# EasyEDA schematic SCH_Quad miner_2023-09-12.json

## Sheets
1 EMC2101: TITLE: Sheet_1; REV: 1.0; Date: 2023-04-18; Sheet: 1/1; Drawn By: abonion1500; Company: Your Company
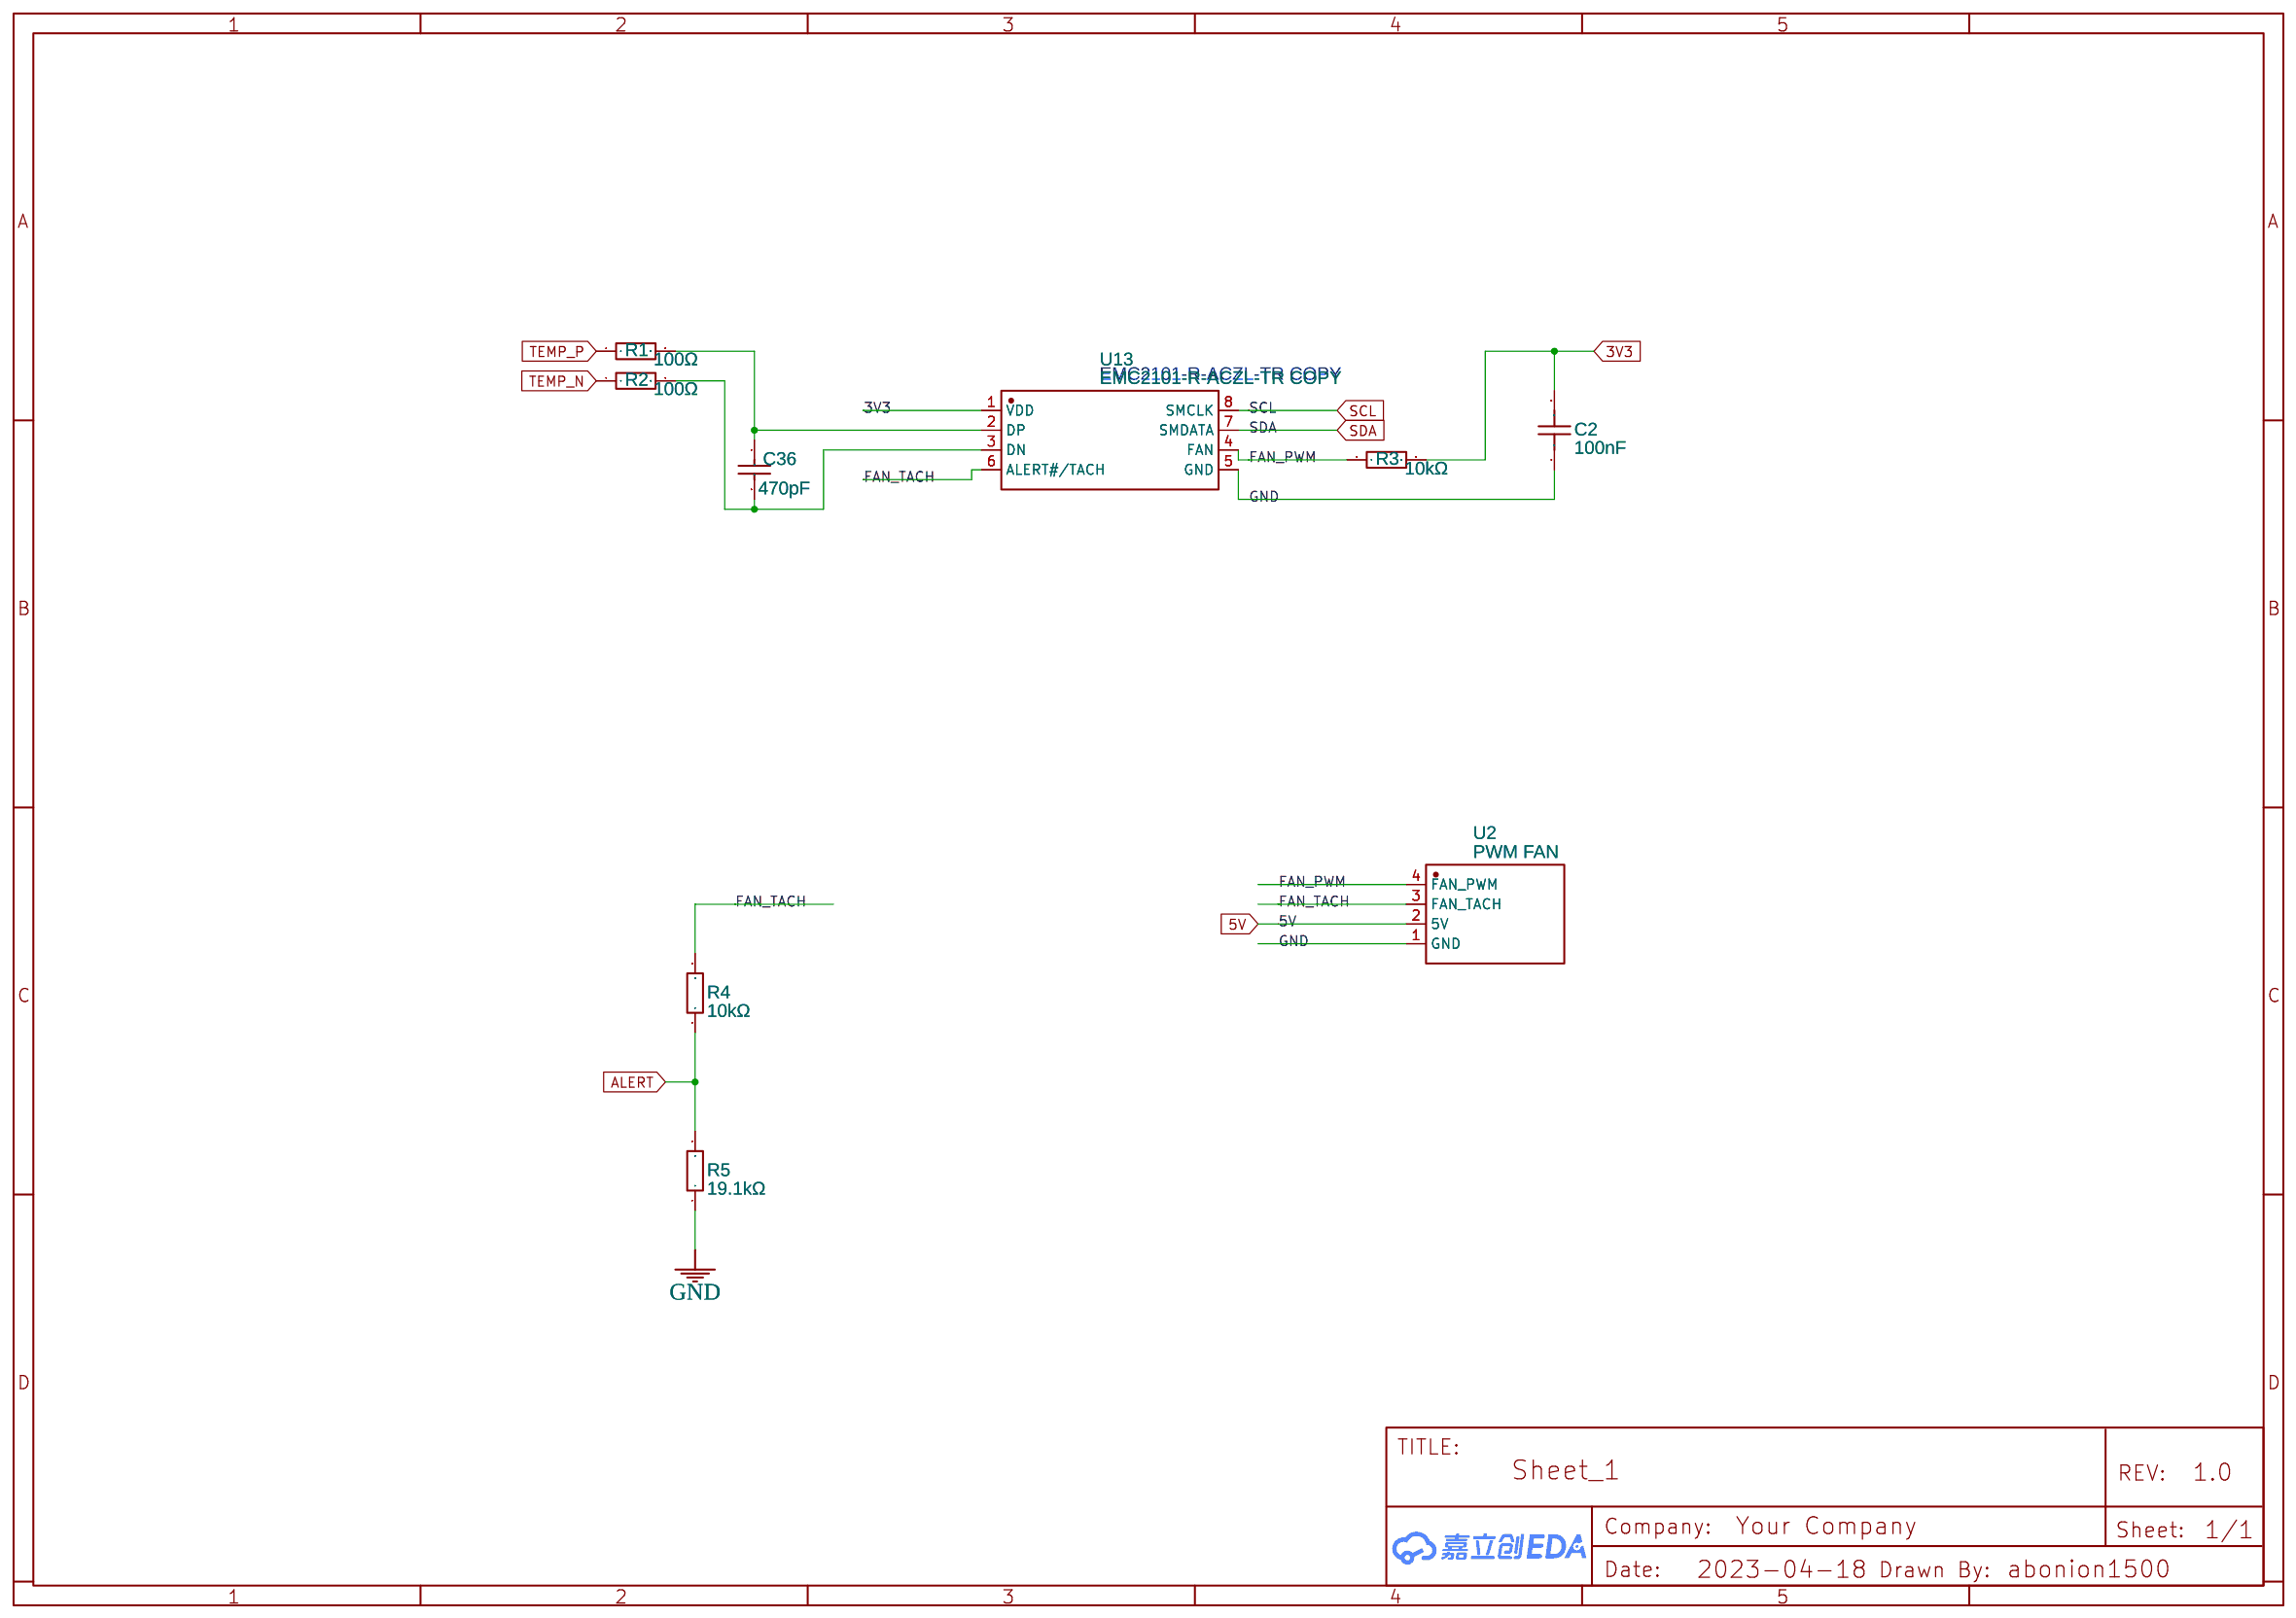
[diagram p0: EMC2101]
2 Logic: Date: 2023-09-11
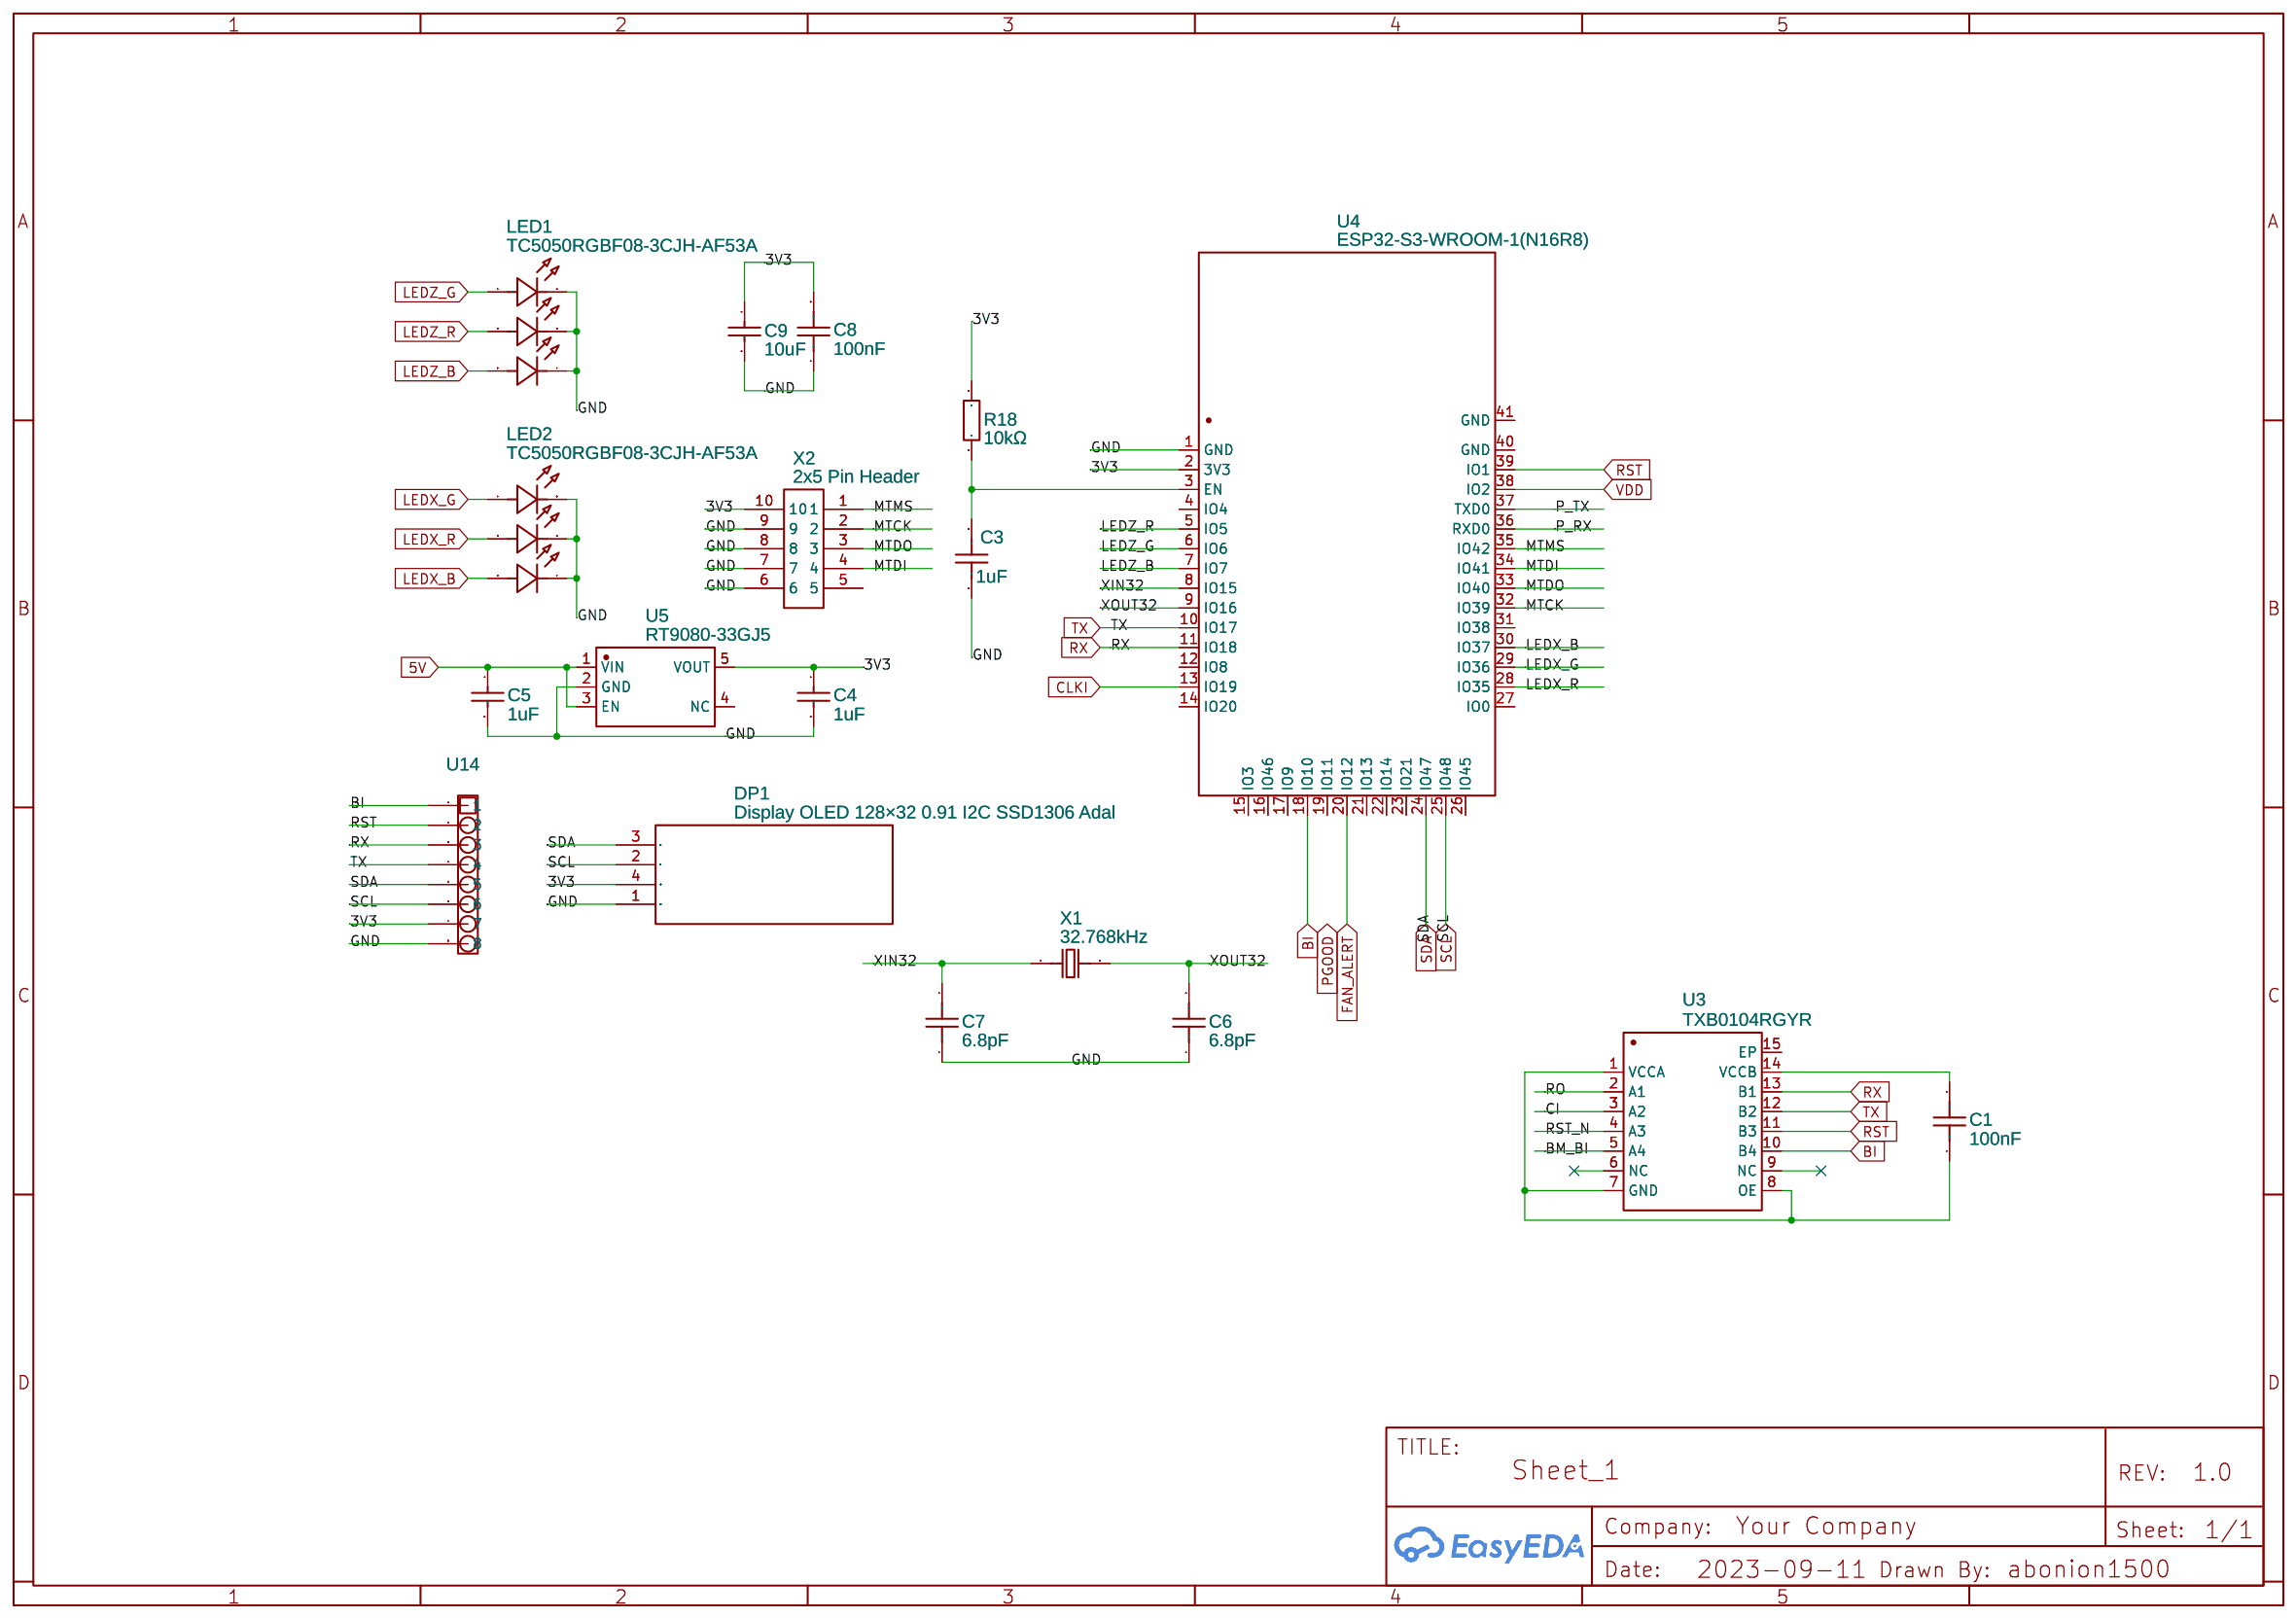
[diagram p1: Logic]
3 Ic1: TITLE: BM1397 MODE1; Date: 2023-07-06; Drawn By: abonion.1500; Company: Abonion1500
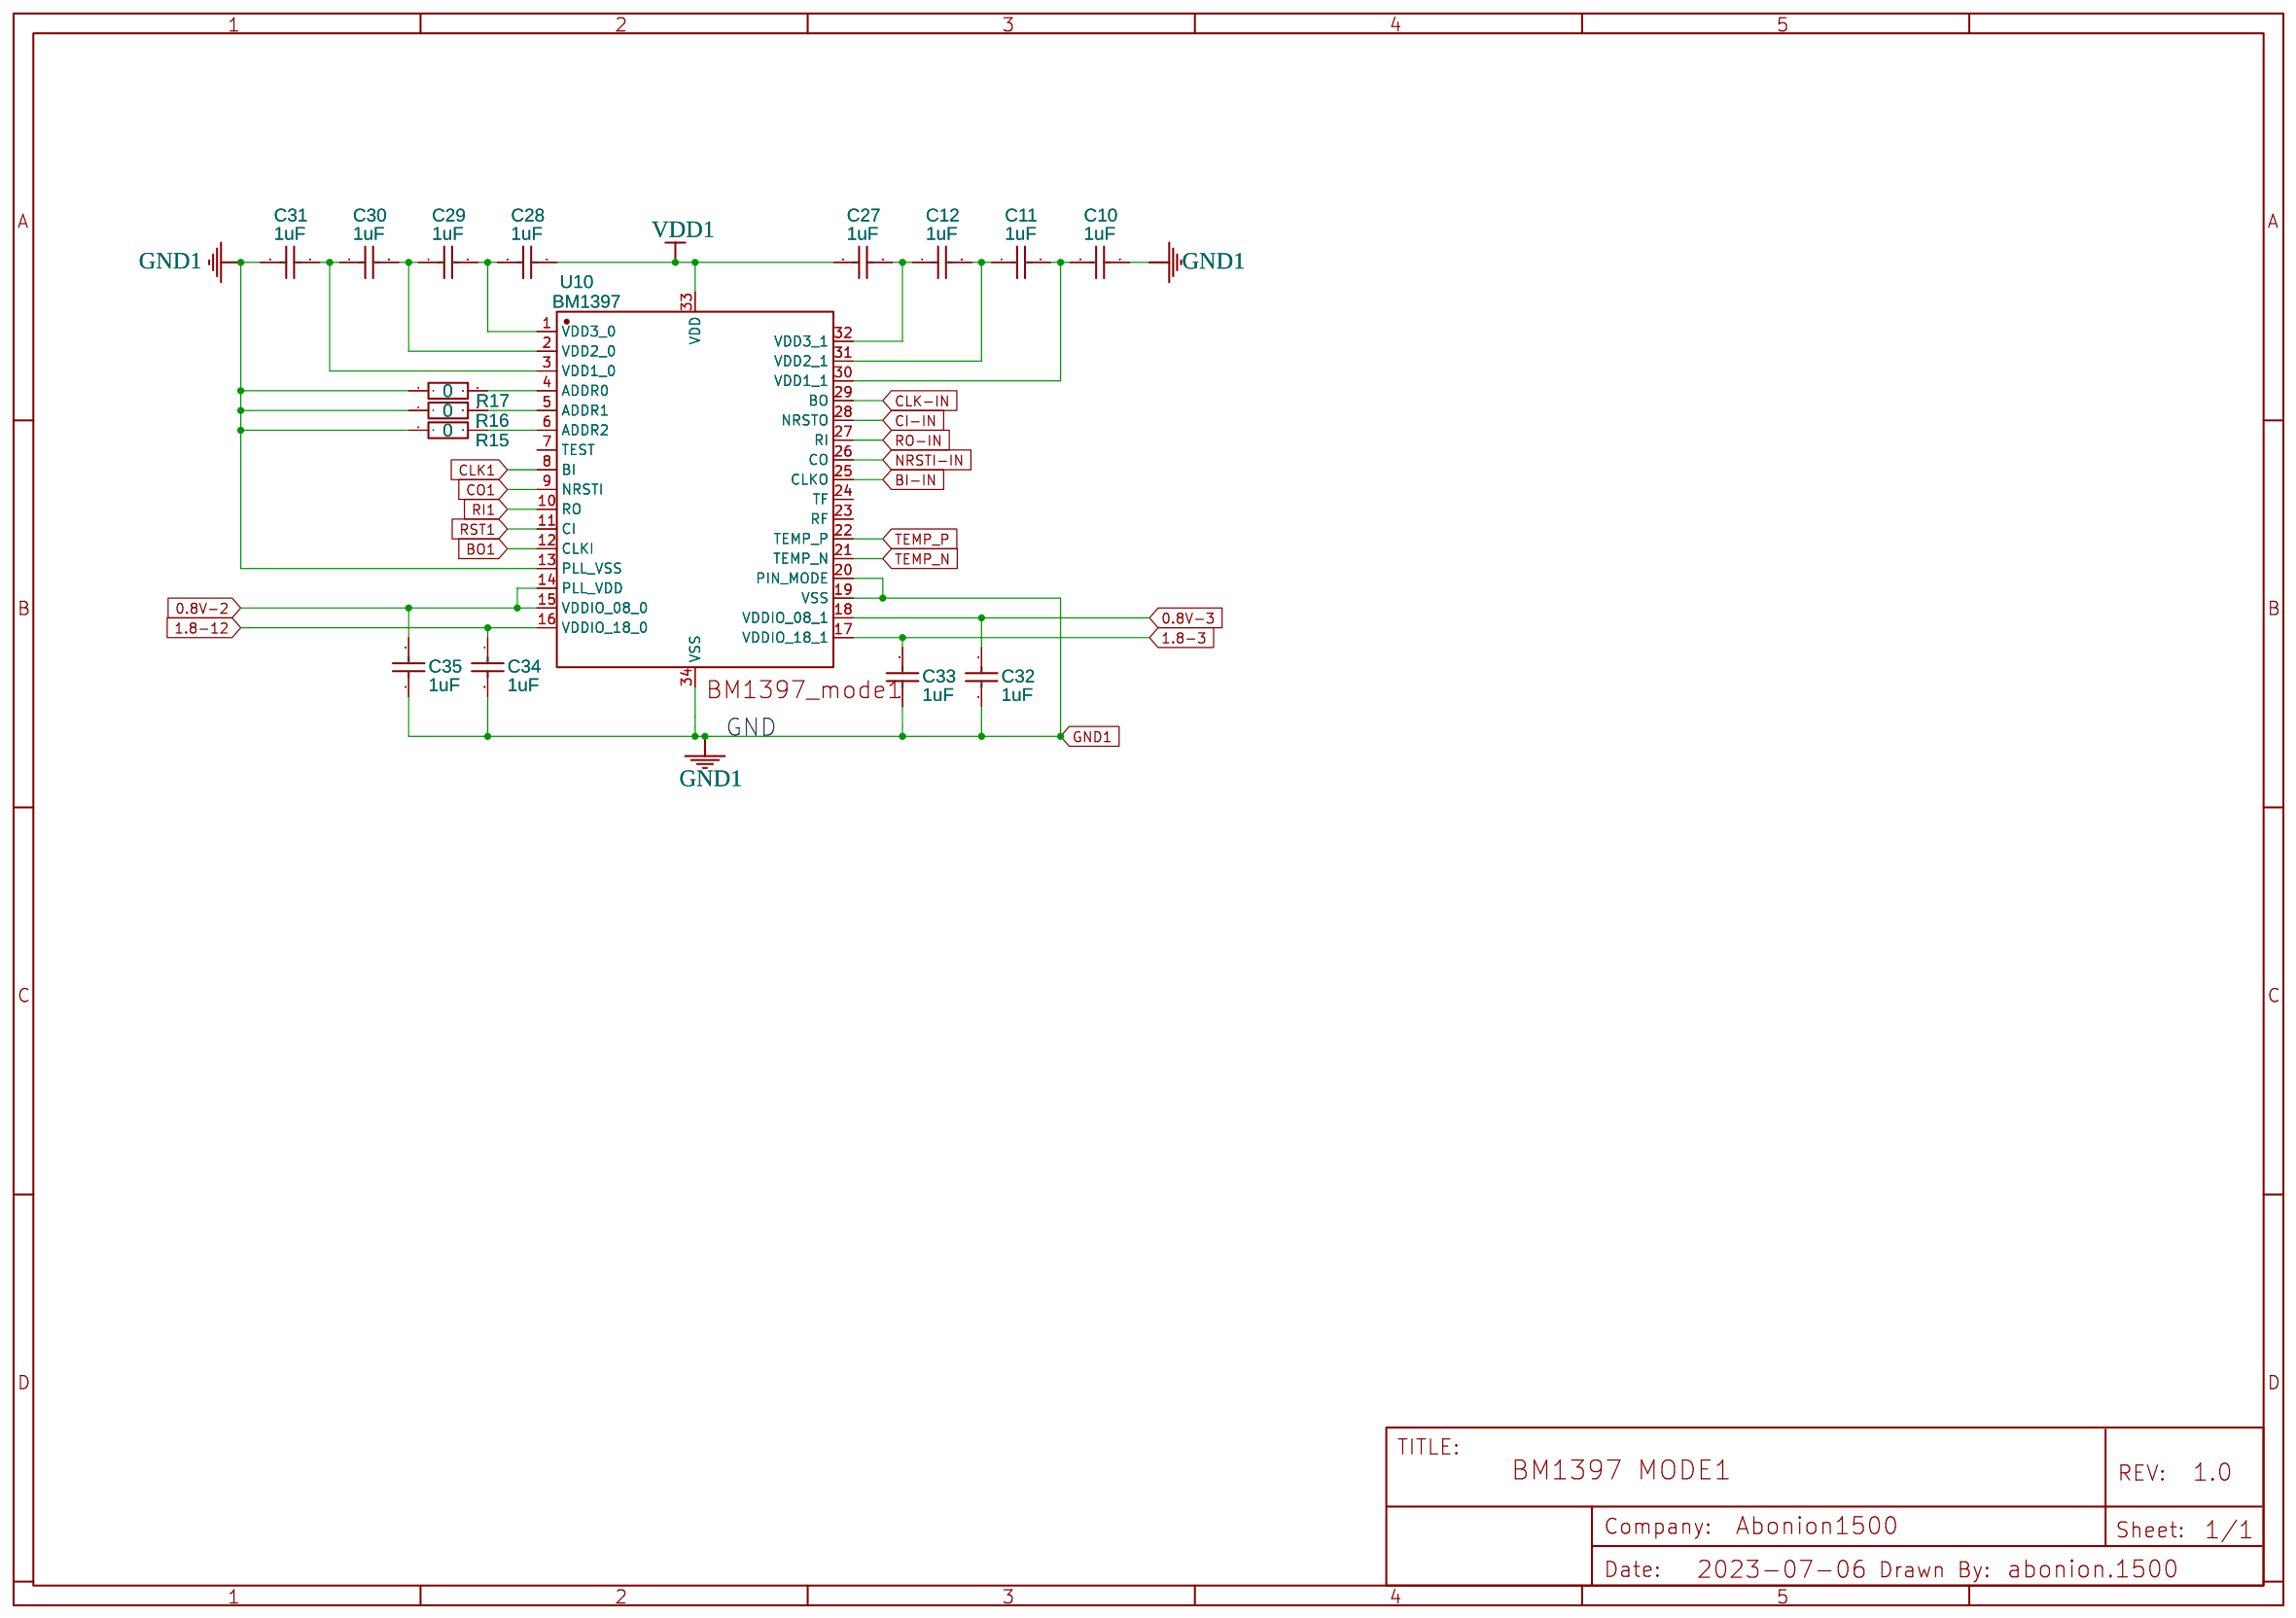
[diagram p2: Ic1]
4 Power main: Date: 2023-09-12
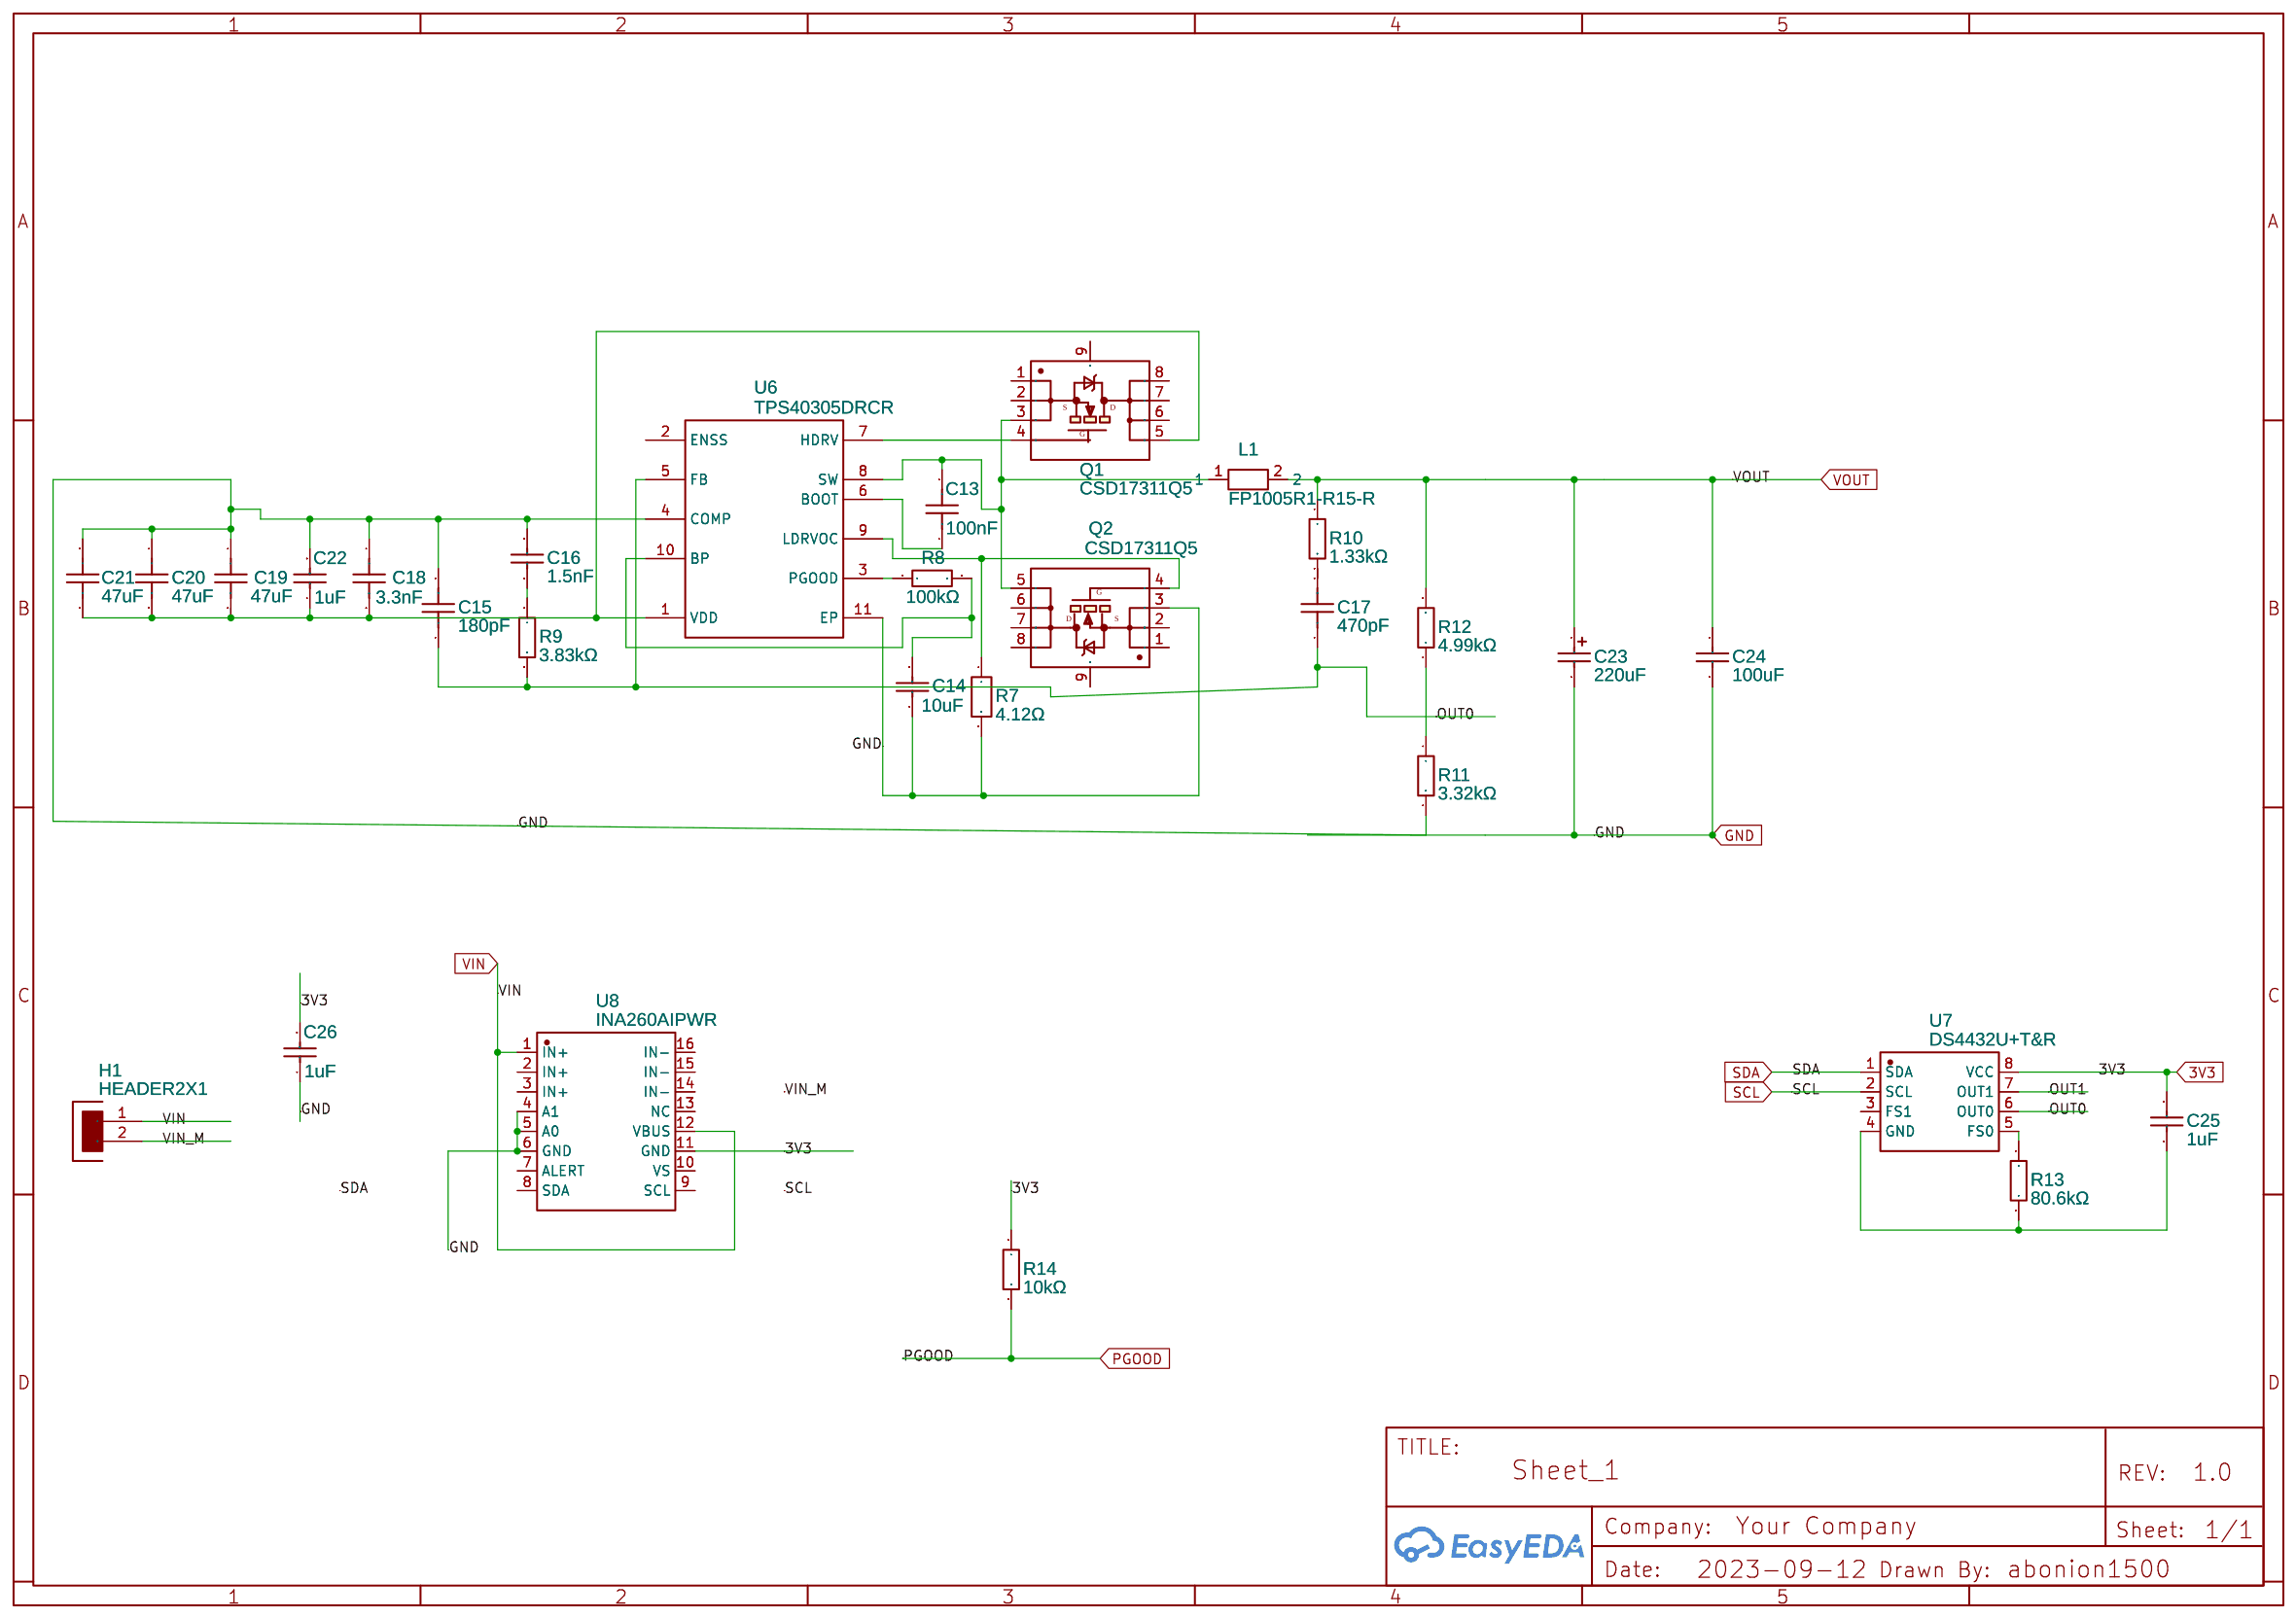
[diagram p3: Power main]
5 Ic2: Date: 2023-07-20; Drawn By: abonion.1500
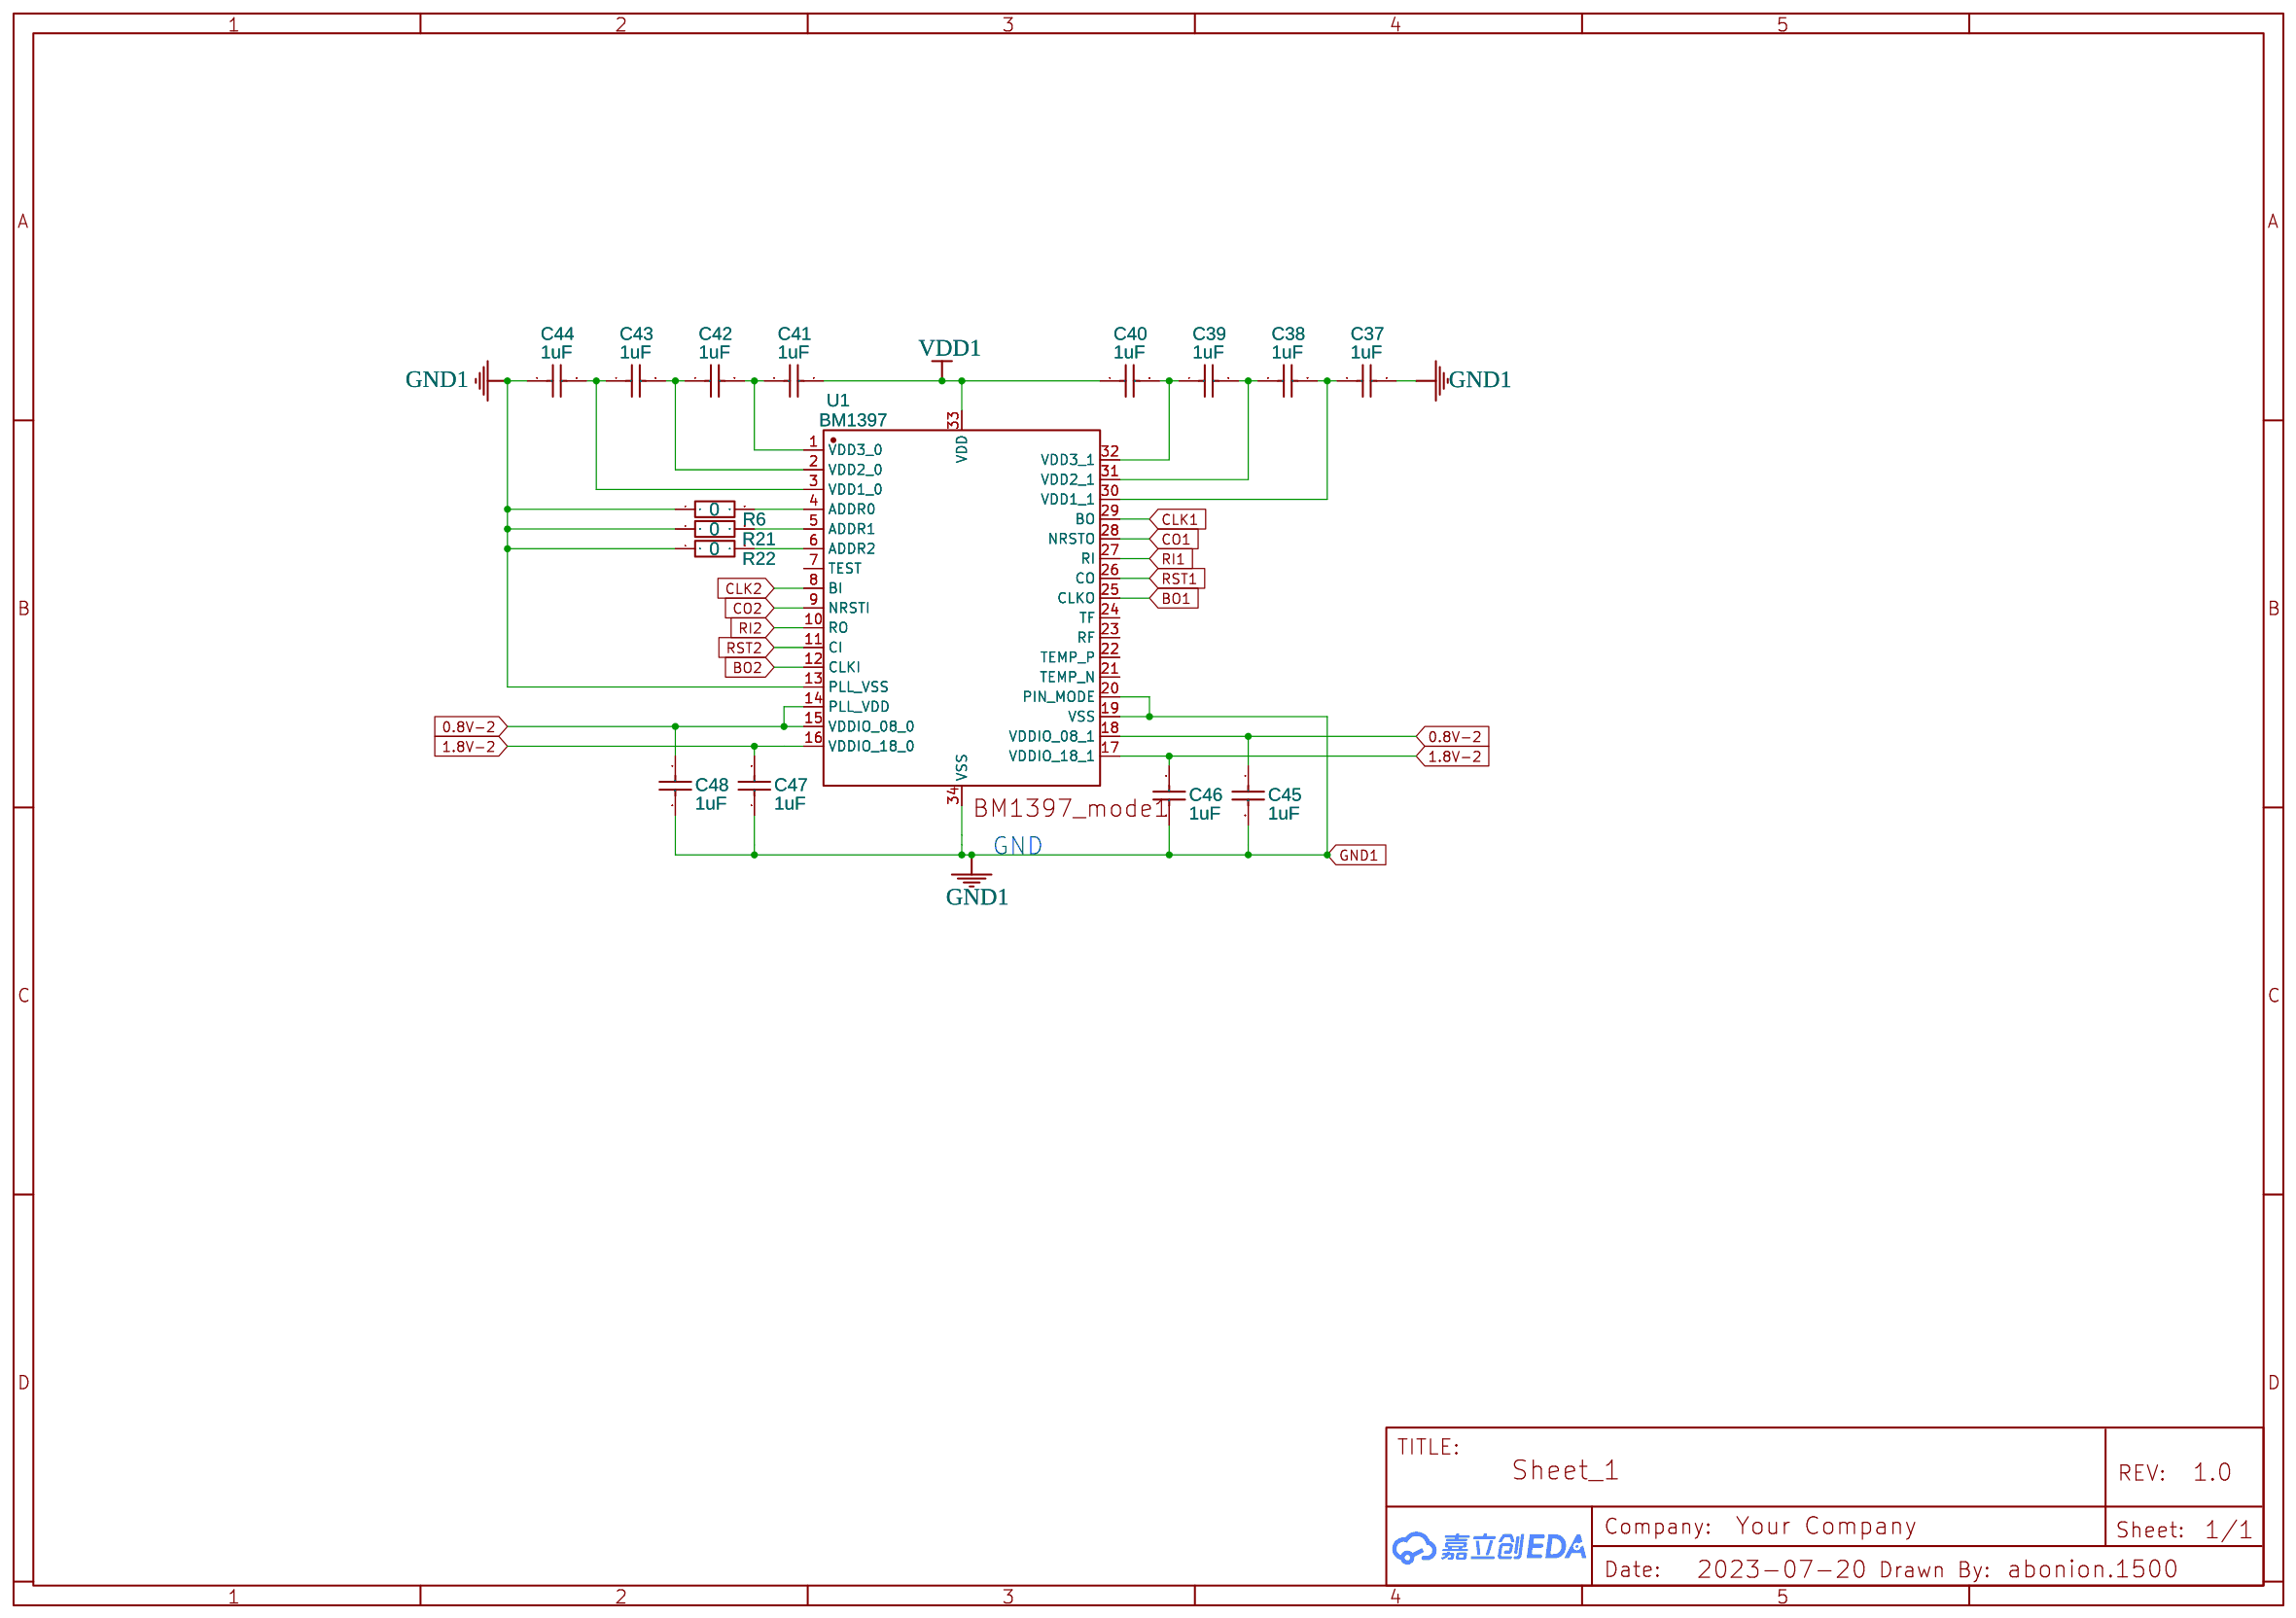
[diagram p4: Ic2]
6 Sheet_1: Date: 2023-09-12
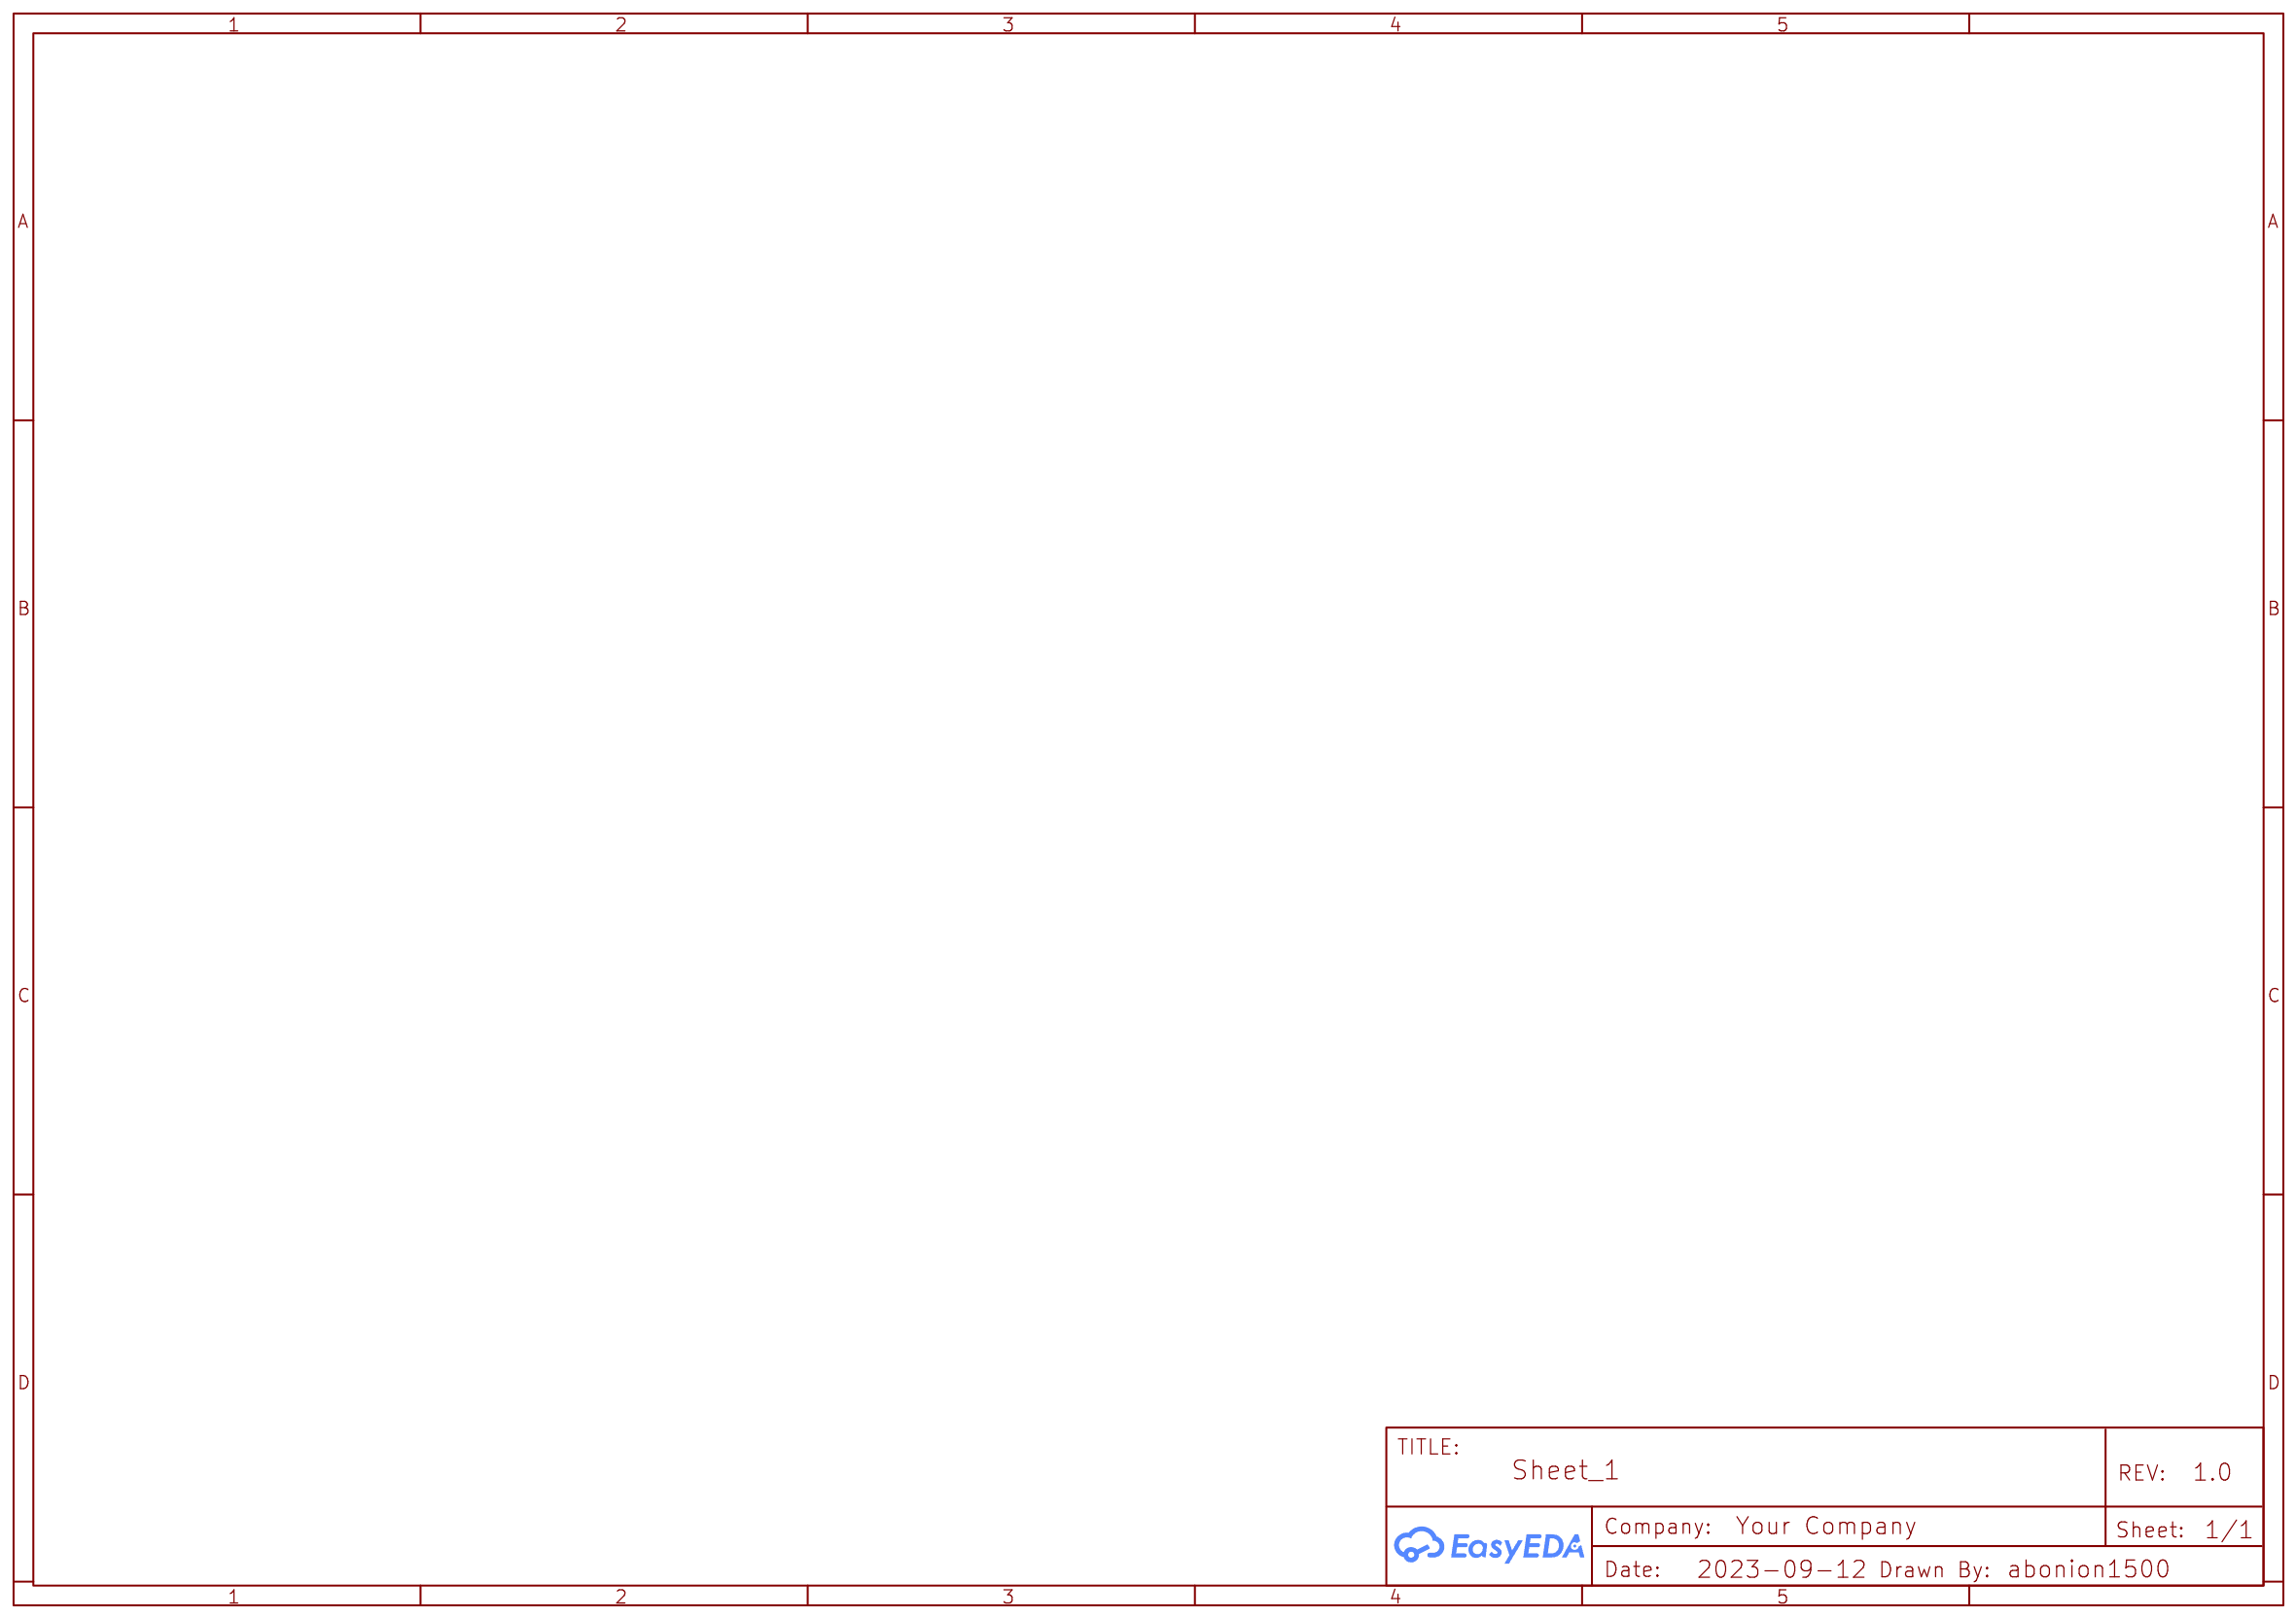
[diagram p5: Sheet_1]
7 Power ASICS: Date: 2023-07-21; Drawn By: abonion.1500
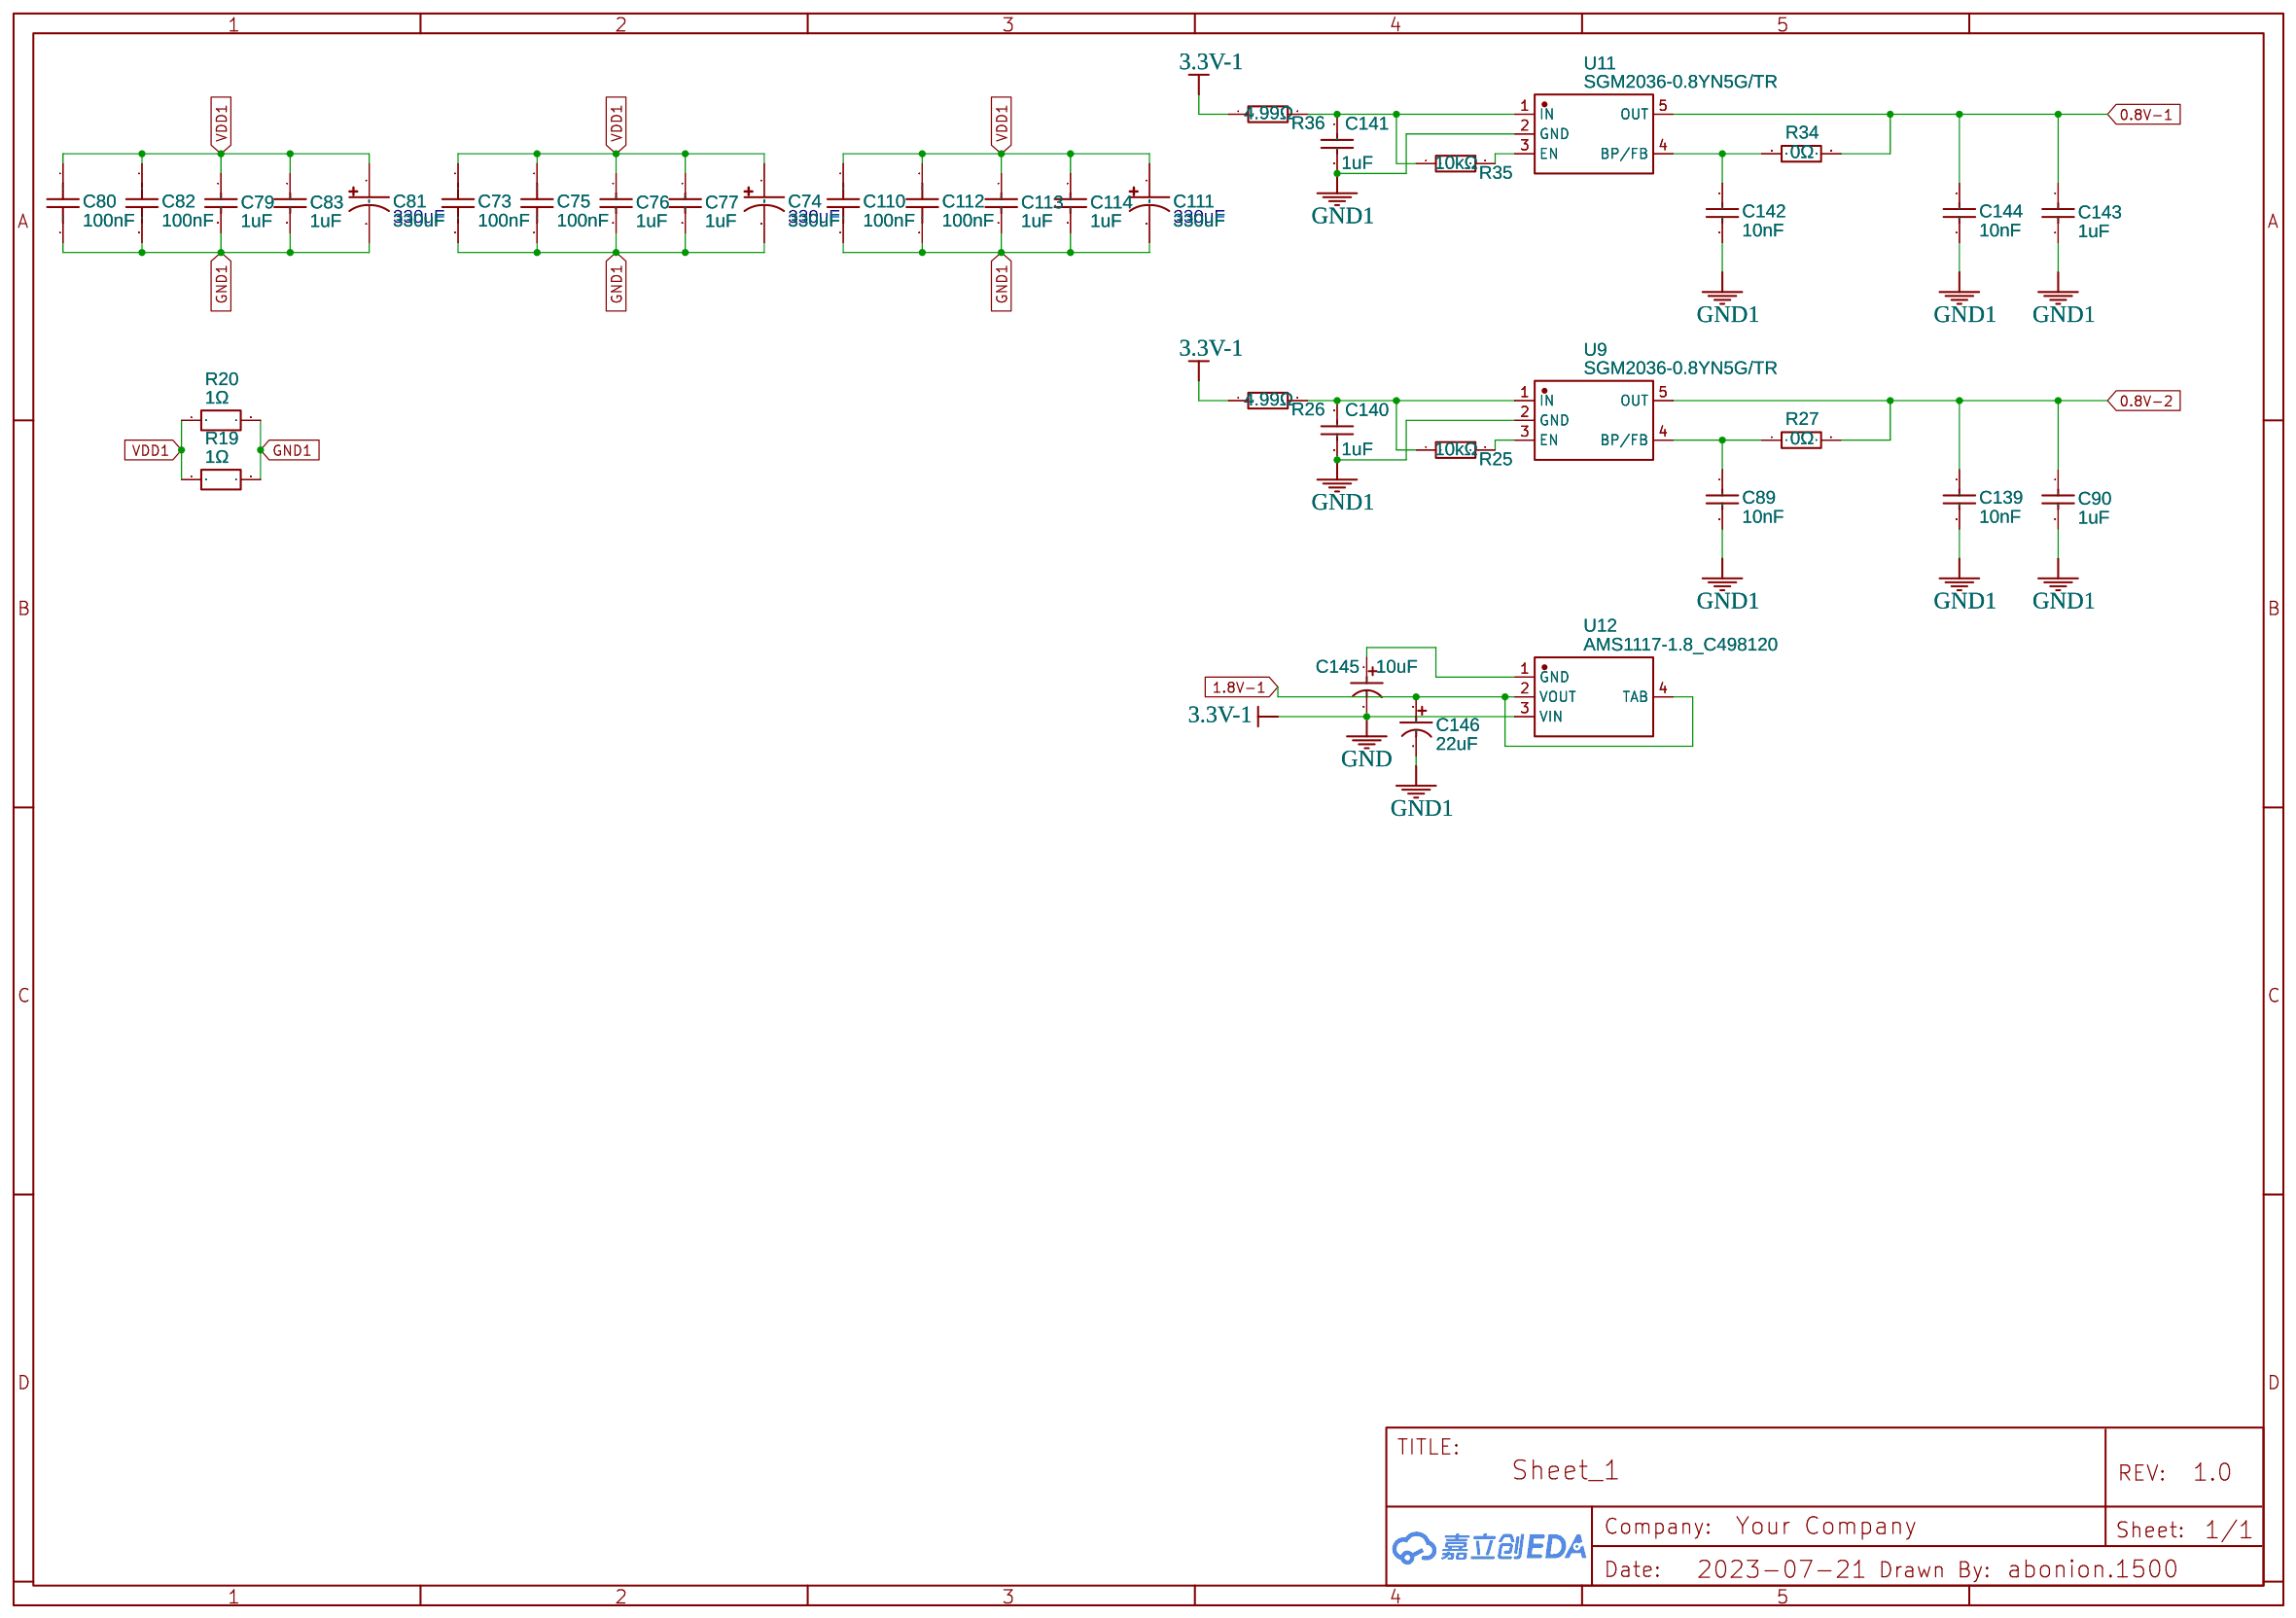
[diagram p6: Power ASICS]

## Parts
sheet EMC2101
C2  100nF  [C0402]
C36  470pF  [C0402]
R1  100Ω  [R0402]
R2  100Ω  [R0402]
R3  10kΩ  [R0402]
R4  10kΩ  [R0402]
R5  19.1kΩ  [R0402]
U2  PWM FAN  [PWM FAN HEADER COPY]
U13  EMC2101-R-ACZL-TR COPY  [MSOP-8_L3.0-W3.0-P0.65-LS4.9-BL]
sheet Ic1
C10  1uF  [C0402]
C11  1uF  [C0402]
C12  1uF  [C0402]
C27  1uF  [C0402]
C28  1uF  [C0402]
C29  1uF  [C0402]
C30  1uF  [C0402]
C31  1uF  [C0402]
C32  1uF  [C0402]
C33  1uF  [C0402]
C34  1uF  [C0402]
C35  1uF  [C0402]
R15  0  [R0402]
R16  0  [R0402]
R17  0  [R0402]
U10  BM1397  [BM1397]
sheet Ic2
C37  1uF  [C0402]
C38  1uF  [C0402]
C39  1uF  [C0402]
C40  1uF  [C0402]
C41  1uF  [C0402]
C42  1uF  [C0402]
C43  1uF  [C0402]
C44  1uF  [C0402]
C45  1uF  [C0402]
C46  1uF  [C0402]
C47  1uF  [C0402]
C48  1uF  [C0402]
R6  0  [R0402]
R21  0  [R0402]
R22  0  [R0402]
U1  BM1397  [BM1397]
sheet Logic
C1  100nF  [C0402]
C3  1uF  [C0603]
C4  1uF  [C0402]
C5  1uF  [C0402]
C6  6.8pF  [C0402]
C7  6.8pF  [C0402]
C8  100nF  [C0402]
C9  10uF  [C0805]
DP1  Display OLED 128×32 0.91 I2C SSD1306 Adal  [0.96OLED_4P]
LED1  TC5050RGBF08-3CJH-AF53A  [LED-SMD_6P-L5.0-W5.0-TL_TC5050RGBF08]
LED2  TC5050RGBF08-3CJH-AF53A  [LED-SMD_6P-L5.0-W5.0-TL_TC5050RGBF08]
R18  10kΩ  [R0402]
U3  TXB0104RGYR  [VQFN-14_L3.5-W3.5-P0.50-BL-EP]
U4  ESP32-S3-WROOM-1(N16R8)  [WIRELM-SMD_ESP32-S3-WROOM-1]
U5  RT9080-33GJ5  [TSOT-23-5_L2.9-W1.6-P0.95-LS2.8-BL]
U14  NO  [1X08 2.54MM HOLES HEADERS PINS]
X1  32.768kHz  [FC-135R_L3.2-W1.5]
X2  2x5 Pin Header  [2X5 PIN HEADERS]
sheet Power ASICS
C73  100nF  [C0402]
C74  330uF  [CAP-SMD_BD8.0-L8.3-W8.3-FD]
C75  100nF  [C0402]
C76  1uF  [C0402]
C77  1uF  [C0402]
C79  1uF  [C0402]
C80  100nF  [C0402]
C81  330uF  [CAP-SMD_BD8.0-L8.3-W8.3-FD]
C82  100nF  [C0402]
C83  1uF  [C0402]
C89  10nF  [C0402]
C90  1uF  [C0402]
C110  100nF  [C0402]
C111  330uF  [CAP-SMD_BD8.0-L8.3-W8.3-FD]
C112  100nF  [C0402]
C113  1uF  [C0402]
C114  1uF  [C0402]
C139  10nF  [C0402]
C140  1uF  [C0402]
C141  1uF  [C0402]
C142  10nF  [C0402]
C143  1uF  [C0402]
C144  10nF  [C0402]
C145  10uF  [CAP-SMD_BD6.3-L6.6-W6.6-FD]
C146  22uF  [CAP-SMD_BD6.3-L6.6-W6.6-LS7.4-FD]
R19  1Ω  [R01005]
R20  1Ω  [R01005]
R25  10kΩ  [R0402]
R26  4.99Ω  [R0201]
R27  0Ω  [R0402]
R34  0Ω  [R0402]
R35  10kΩ  [R0402]
R36  4.99Ω  [R0201]
U9  SGM2036-0.8YN5G/TR  [SOT-23-5_L2.9-W1.6-P0.95-LS2.8-BR]
U11  SGM2036-0.8YN5G/TR  [SOT-23-5_L2.9-W1.6-P0.95-LS2.8-BR]
U12  AMS1117-1.8_C498120  [SOT-223-3_L6.5-W3.4-P2.30-LS7.0-BR]
sheet Power main
C13  100nF  [C0402]
C14  10uF  [C0805]
C15  180pF  [C0805]
C16  1.5nF  [C0805]
C17  470pF  [C0805]
C18  3.3nF  [C0402]
C19  47uF  [C1210]
C20  47uF  [C1210]
C21  47uF  [C1210]
C22  1uF  [C0603]
C23  220uF  [CAP-SMD_L7.3-W4.3-L-FD]
C24  100uF  [C1206]
C25  1uF  [C0402]
C26  1uF  [C0603]
H1  HEADER2X1  [HEADER2X1_CL]
L1  FP1005R1-R15-R  [FP1005R1-R15-R]
Q1  CSD17311Q5  [VSON-8_L6.0-W5.0-P1.27-BL-EP]
Q2  CSD17311Q5  [VSON-8_L6.0-W5.0-P1.27-BL-EP]
R7  4.12Ω  [R0402]
R8  100kΩ  [R0402]
R9  3.83kΩ  [R0402]
R10  1.33kΩ  [R0402]
R11  3.32kΩ  [R0402]
R12  4.99kΩ  [R0402]
R13  80.6kΩ  [R0402]
R14  10kΩ  [R0402]
U6  TPS40305DRCR  [VSON-10_L3.0-W3.0-P0.50-BL-EP_TPS62410DRCR]
U7  DS4432U+T&R  [UMAX-8_L3.0-W3.0-P0.65-LS4.9-BL]
U8  INA260AIPWR  [TSSOP-16_L5.0-W4.4-P0.65-LS6.4-BL-1]

## Library data of the parts
C1 C2 C8 C13 = 0402X104K100CT: Contributor: LCSC; Supplier: LCSC; Supplier Part: C387958; Manufacturer: Walsin(华新科); JLCPCB Part Class: Extended Part; link: https://lcsc.com/eda_search?q=C387958&%26type=1&ref=editor
C36 = CL05B471KB5NNNC: Supplier: LCSC; Manufacturer: SAMSUNG(三星); Supplier Part: C26412; JLCPCB Part Class: Extended Part; link: https://lcsc.com/eda_search?q=C26412&%26type=1&ref=editor
R1 R2 = RMCF0402FT100R: Contributor: LCSC; Supplier: LCSC; Supplier Part: C237740; Manufacturer: SEI(Stackpole Electronics Inc.); JLCPCB Part Class: Extended Part; link: https://lcsc.com/eda_search?q=C237740&%26type=1&ref=editor
R3 R14 R18 = RC0402JR-0710KL: Supplier: LCSC; Manufacturer: YAGEO(国巨); Supplier Part: C60489; JLCPCB Part Class: Extended Part; link: https://lcsc.com/eda_search?q=C60489&%26type=1&ref=editor
R4 = RC-02W103JT_C140214: Contributor: LCSC; Supplier: LCSC; Supplier Part: C140214; Manufacturer: FH(风华); Manufacturer Part: RC-02W103JT; JLCPCB Part Class: Extended Part; link: https://lcsc.com/eda_search?q=C140214&%26type=1&ref=editor
R5 = 0402WGF1912TCE: Supplier: LCSC; Manufacturer: UNI-ROYAL(厚声); Supplier Part: C52036; JLCPCB Part Class: Extended Part; link: https://lcsc.com/eda_search?q=C52036&%26type=1&ref=editor
U2 = PWM FAN: Contributor: abonion1500
U13 = EMC2101-R-ACZL-TR COPY: Contributor: lcsc; Supplier: LCSC; Supplier Part: C626968; Manufacturer: MICROCHIP(美国微芯); Manufacturer Part: EMC2101-R-ACZL-TR; JLCPCB Part Class: Extended Part
C10-C12 C25 C27-C35 C37-C48 C76 C77 C79 C83 C90 C113 C114 C140 C141 C143 = CL05A105KO5NNNC: Supplier: LCSC; Manufacturer: SAMSUNG(三星); Supplier Part: C29266; JLCPCB Part Class: Extended Part
R6 R15-R17 R21 R22 = RC0402JR-070RL: Supplier: LCSC; Manufacturer: YAGEO(国巨); Supplier Part: C60485; JLCPCB Part Class: Extended Part; Resistance: 0Ω
U1 U10 = BM1397: Manufacturer: Bitmain; Contributor: abonion.1500
C3 = 0603X105J160CT: Contributor: LCSC; Supplier: LCSC; Supplier Part: C458913; Manufacturer: Walsin(华新科); JLCPCB Part Class: Extended Part; link: https://lcsc.com/eda_search?q=C458913&%26type=1&ref=editor
C4 C5 = CL05A105KO5NNNC: Supplier: LCSC; Manufacturer: SAMSUNG(三星); Supplier Part: C29266; JLCPCB Part Class: Extended Part; link: https://lcsc.com/eda_search?q=C29266&%26type=1&ref=editor
C6 C7 = C1005NPO689DGT: Contributor: LCSC; Supplier: LCSC; Supplier Part: C258499; Manufacturer: DARFON(达方); Manufacturer Part: C1005NP0689DGT; JLCPCB Part Class: Extended Part; link: https://lcsc.com/eda_search?q=C258499&%26type=1&ref=editor
C9 C14 = CL21A106KOQNNNE: Supplier: LCSC; Manufacturer: SAMSUNG(三星); Supplier Part: C1713; JLCPCB Part Class: Extended Part; link: https://lcsc.com/eda_search?q=C1713&%26type=1&ref=editor
DP1 = Display OLED 128×32 0.91 I2C SSD1306 Adal: Contributor: adal
LED1 LED2 = TC5050RGBF08-3CJH-AF53A: Contributor: LCSC; Supplier: LCSC; Supplier Part: C784540; Manufacturer: TCWIN(天成); JLCPCB Part Class: Extended Part; link: https://lcsc.com/eda_search?q=C784540&%26type=1&ref=editor
U3 = TXB0104RGYR: Contributor: LCSC; Supplier: LCSC; Supplier Part: C400708; Manufacturer: TI(德州仪器); JLCPCB Part Class: Extended Part; link: https://lcsc.com/eda_search?q=C400708&%26type=1&ref=editor
U4 = ESP32-S3-WROOM-1(N16R8): Contributor: lcsc; Supplier: LCSC; Supplier Part: C2913202; Manufacturer: ESPRESSIF(乐鑫); Manufacturer Part: ESP32-S3-WROOM-1-N16R8; JLCPCB Part Class: Extended Part; link: https://lcsc.com/eda_search?q=C2913202&%26type=1&ref=editor
U5 = RT9080-33GJ5: Contributor: LCSC; Supplier: LCSC; Supplier Part: C841192; Manufacturer: RICHTEK(台湾立锜); JLCPCB Part Class: Extended Part; link: https://lcsc.com/eda_search?q=C841192&%26type=1&ref=editor
U14 = Header pins 1X08: Contributor: fabiano.riccardi
X1 = Q13FC1350000200: Supplier: LCSC; Manufacturer: EPSON(爱普生); Supplier Part: C48615; JLCPCB Part Class: Extended Part; link: https://lcsc.com/eda_search?q=C48615&%26type=1&ref=editor
X2 = 2x5 Pin Header: Contributor: WooDFox
C73 C75 C80 C82 C110 C112 = CC0402KRX7R7BB104: Supplier: LCSC; Manufacturer: YAGEO(国巨); Supplier Part: C60474; JLCPCB Part Class: Extended Part
C74 C81 C111 = RVE1C331M0810: Supplier: LCSC; Manufacturer: HONOR(荣誉); Supplier Part: C88669; JLCPCB Part Class: Extended Part
C89 C139 C142 C144 = 0402B103K500NT: Supplier: LCSC; Manufacturer: FH(风华); Supplier Part: C1524; JLCPCB Part Class: Extended Part
C145 = RVT2A100M0607: Supplier: LCSC; Manufacturer: ROQANG(容强); Supplier Part: C72482; JLCPCB Part Class: Extended Part
C146 = RT1J220M0607: Contributor: LCSC; Supplier: LCSC; Supplier Part: C267472; Manufacturer: ROQANG(容强); JLCPCB Part Class: Extended Part
R19 R20 = 0105WHF100KTDE: Supplier: LCSC; Supplier Part: C560312; Manufacturer: UNI-ROYAL(厚声); Contributor: LCSC
R25 R35 = 0402WGF1002TCE: Supplier: LCSC; Manufacturer: UNI-ROYAL(厚声); Supplier Part: C25744; Resistance (Ohms): 10K; JLCPCB Part Class: Basic Part
R26 R36 = RTT014R99FTH: Supplier: LCSC; Manufacturer: RALEC(旺诠); Resistance (Ohms): 4.99; Contributor: LCSC; Supplier Part: C158479
R27 R34 = 0402WGF0000TCE: Supplier: LCSC; Manufacturer: UNI-ROYAL(厚声); Supplier Part: C17168; Resistance (Ohms): 0; JLCPCB Part Class: Basic Part
U9 U11 = SGM2036-0.8YN5G/TR: Supplier: LCSC; Supplier Part: C700345; Manufacturer: SGMICRO(圣邦微); link: https://atta.szlcsc.comnull; Contributor: lcsc; JLCPCB Part Class: Extended Part
U12 = AMS1117-1.8_C498120: Contributor: LCSC; Supplier: LCSC; Supplier Part: C498120; Manufacturer: HGC(华冠); Manufacturer Part: AMS1117-1.8; JLCPCB Part Class: Extended Part
C15 = CC0805JRNPO9BN181: Contributor: LCSC; Supplier: LCSC; Supplier Part: C113826; Manufacturer: YAGEO(国巨); JLCPCB Part Class: Extended Part; link: https://lcsc.com/eda_search?q=C113826&%26type=1&ref=editor
C16 = CC0805KRX7R9BB152: Supplier: LCSC; Manufacturer: YAGEO(国巨); Supplier Part: C107142; JLCPCB Part Class: Extended Part; link: https://lcsc.com/eda_search?q=C107142&%26type=1&ref=editor
C17 = 0805B471K500CT: Contributor: LCSC; Supplier: LCSC; Supplier Part: C338123; Manufacturer: Walsin(华新科); JLCPCB Part Class: Extended Part; link: https://lcsc.com/eda_search?q=C338123&%26type=1&ref=editor
C18 = CL05B332KB5NNNC: Supplier: LCSC; Manufacturer: SAMSUNG(三星); Supplier Part: C26404; JLCPCB Part Class: Basic Part; link: https://lcsc.com/eda_search?q=C26404&%26type=1&ref=editor
C19-C21 = GRM32ER61C476KE15L: Supplier: LCSC; Manufacturer: muRata(村田); Supplier Part: C77101; JLCPCB Part Class: Extended Part; link: https://lcsc.com/eda_search?q=C77101&%26type=1&ref=editor
C22 C26 = CL10A105KO8NNNC: Supplier: LCSC; Manufacturer: SAMSUNG(三星); Supplier Part: C1592; JLCPCB Part Class: Extended Part; link: https://lcsc.com/eda_search?q=C1592&%26type=1&ref=editor
C23 = 2R5TPE220MF: Contributor: LCSC; Supplier: LCSC; Supplier Part: C437671; Manufacturer: PANASONIC(松下); JLCPCB Part Class: Extended Part; link: https://lcsc.com/eda_search?q=C437671&%26type=1&ref=editor
C24 = CL31A107MQHNNNE: Supplier: LCSC; Manufacturer: SAMSUNG(三星); Supplier Part: C15008; JLCPCB Part Class: Basic Part; link: https://lcsc.com/eda_search?q=C15008&%26type=1&ref=editor
H1 = HEADER2X1: Contributor: alexanderxxxx; sourceId: gEezxvt31; Manufacturer Part: n/a; Supplier Part: n/a; Manufacturer: n/a; link: n/a
L1 = FP1005R1-R15-R: Contributor: abonion1500; Package Display: No
Q1 Q2 = CSD17311Q5: Contributor: LCSC; Supplier: LCSC; Supplier Part: C139640; Manufacturer: TI(德州仪器); JLCPCB Part Class: Extended Part; link: https://lcsc.com/eda_search?q=C139640&%26type=1&ref=editor
R7 = RC0402FR-074R12L: Contributor: LCSC; Supplier: LCSC; Supplier Part: C477720; Manufacturer: YAGEO(国巨); JLCPCB Part Class: Extended Part; link: https://lcsc.com/eda_search?q=C477720&%26type=1&ref=editor
R8 = RC0402JR-07100KL: Supplier: LCSC; Manufacturer: YAGEO(国巨); Supplier Part: C106234; JLCPCB Part Class: Extended Part; link: https://lcsc.com/eda_search?q=C106234&%26type=1&ref=editor
R9 = RC0402FR-073K83L: Contributor: LCSC; Supplier: LCSC; Supplier Part: C185417; Manufacturer: YAGEO(国巨); JLCPCB Part Class: Extended Part; link: https://lcsc.com/eda_search?q=C185417&%26type=1&ref=editor
R10 = RC0402FR-071K33L: Contributor: LCSC; Supplier: LCSC; Supplier Part: C276261; Manufacturer: YAGEO(国巨); JLCPCB Part Class: Extended Part; link: https://lcsc.com/eda_search?q=C276261&%26type=1&ref=editor
R11 = RC0402FR-073K32L: Supplier: LCSC; Manufacturer: YAGEO(国巨); Supplier Part: C137993; JLCPCB Part Class: Extended Part; link: https://lcsc.com/eda_search?q=C137993&%26type=1&ref=editor
R12 = RC0402FR-074K99L: JLCPCB Part Class: Extended Part; Supplier: LCSC; Manufacturer: YAGEO(国巨); Supplier Part: C137965; link: https://lcsc.com/eda_search?q=C137965&%26type=1&ref=editor
R13 = RC0402FR-0780K6L: Contributor: LCSC; Supplier: LCSC; Manufacturer: YAGEO(国巨); Supplier Part: C155698; JLCPCB Part Class: Extended Part; link: https://lcsc.com/eda_search?q=C155698&%26type=1&ref=editor
U6 = TPS40305DRCR: Contributor: LCSC; Supplier: LCSC; Supplier Part: C140285; Manufacturer: TI(德州仪器); JLCPCB Part Class: Extended Part; link: https://lcsc.com/eda_search?q=C140285&%26type=1&ref=editor
U7 = DS4432U+T&amp;R: Contributor: LCSC; Supplier: LCSC; Supplier Part: C2679620; Manufacturer: ADI(亚德诺)/MAXIM(美信); JLCPCB Part Class: Extended Part; link: https://lcsc.com/eda_search?q=C2679620&%26type=1&ref=editor
U8 = INA260AIPWR: Contributor: lcsc; Supplier: LCSC; Supplier Part: C2155885; Manufacturer: TI(德州仪器); JLCPCB Part Class: Extended Part; link: https://lcsc.com/eda_search?q=C2155885&%26type=1&ref=editor

## Nets
0.8V-1: C143.1 C144.1 R34.2 U11.5(OUT)
0.8V-2: C35.1 C45.1 C48.1 C90.1 C139.1 R27.2 U1.14(PLL_VDD) U1.15(VDDIO_08_0) U1.18(VDDIO_08_1) U9.5(OUT) U10.14(PLL_VDD) U10.15(VDDIO_08_0)
0.8V-3: C32.1 U10.18(VDDIO_08_1)
1.8V-1: C146.1 U12.2(VOUT) U12.4(TAB)
1.8V-2: C46.1 C47.1 U1.16(VDDIO_18_0) U1.17(VDDIO_18_1)
3.3V-1: C2.1 C3.2 C4.2 C5.2 C6.1 C7.1 C8.1 C9.2 C14.1 C23.2 C24.2 C26.1 C145.2 DP1.1(GND) LED1.4(-) LED1.5(-) LED1.6(-) LED2.4(-) LED2.5(-) LED2.6(-) Q2.3(S) R5.1 R7.2 R26.1 R36.1 U2.1(GND) U4.1(GND) U5.2(GND) U6.11(EP) U8.4(A1) U8.5(A0) U8.6(GND) U12.3(VIN) U13.5(GND) U14.8 X2.6 X2.7 X2.8 X2.9
3V3: C2.2 C4.1 C8.2 C9.1 C25.1 C26.2 DP1.4(VCC) R3.2 R14.1 R18.1 U4.2(3V3) U5.5(VOUT) U7.8(VCC) U8.11(GND) U13.1(VDD) U14.7 X2.10
5V: C5.1 U2.2(5V) U5.1(VIN) U5.3(EN)
GND1: C10.2 C31.1 C32.2 C33.2 C34.2 C35.2 C37.2 C44.1 C45.2 C46.2 C47.2 C48.2 C73.2 C74.2 C75.2 C76.2 C77.2 C79.2 C80.2 C81.2 C82.2 C83.2 C89.2 C90.2 C110.2 C111.2 C112.2 C113.2 C114.2 C139.2 C140.2 C141.2 C142.2 C143.2 C144.2 C146.2 R6.1 R15.1 R16.1 R17.1 R19.2 R20.2 R21.1 R22.1 U1.13(PLL_VSS) U1.19(VSS) U1.20(PIN_MODE) U1.34(VSS) U9.2(GND) U10.13(PLL_VSS) U10.19(VSS) U10.20(PIN_MODE) U10.34(VSS) U11.2(GND)
VDD: U4.38(IO2)
VDD1: C27.1 C28.2 C40.1 C41.2 C73.1 C74.1 C75.1 C76.1 C77.1 C79.1 C80.1 C81.1 C82.1 C83.1 C110.1 C111.1 C112.1 C113.1 C114.1 R19.1 R20.1 U1.33(VDD) U10.33(VDD)
VIN: H1.1 U8.1(IN+) U8.12(VBUS)
VIN_M: H1.2
1.8-3: C33.1 U10.17(VDDIO_18_1)
1.8-12: C34.1 U10.16(VDDIO_18_0)
ALERT: R4.1 R5.2
BI: U3.10(B4) U4.18(IO10) U14.1
BI-IN: U10.25(CLKO)
BM_BI: U3.5(A4)
BO1: U1.25(CLKO) U10.12(CLKI)
BO2: U1.12(CLKI)
CI: U3.3(A2)
CI-IN: U10.28(NRSTO)
CLK1: U1.29(BO) U10.8(BI)
CLK2: U1.8(BI)
CLK-IN: U10.29(BO)
CLKI: U4.13(IO19)
CO1: U1.28(NRSTO) U10.9(NRSTI)
CO2: U1.9(NRSTI)
FAN_ALERT: U4.20(IO12)
FAN_PWM: R3.1 U2.4(FAN_PWM) U13.4(FAN)
FAN_TACH: R4.2 U2.3(FAN_TACH) U13.6(ALERT#/TACH)
LEDX_B: LED2.3(+) U4.30(IO37)
LEDX_G: LED2.1(+) U4.29(IO36)
LEDX_R: LED2.2(+) U4.28(IO35)
LEDZ_B: LED1.3(+) U4.7(IO7)
LEDZ_G: LED1.1(+) U4.6(IO6)
LEDZ_R: LED1.2(+) U4.5(IO5)
MTCK: U4.32(IO39) X2.2
MTDI: U4.34(IO41) X2.4
MTDO: U4.33(IO40) X2.3
MTMS: U4.35(IO42) X2.1
NRSTI-IN: U10.26(CO)
OUT0: C15.1 C17.1 R9.2 U6.5(FB) U7.6(OUT0)
OUT1: U7.7(OUT1)
P_RX: U4.36(RXD0)
P_TX: U4.37(TXD0)
PGOOD: R14.2
RI1: U1.27(RI) U10.10(RO)
RI2: U1.10(RO)
RO: U3.2(A1)
RO-IN: U10.27(RI)
RST: U3.11(B3) U4.39(IO1) U14.2
RST1: U1.26(CO) U10.11(CI)
RST2: U1.11(CI)
RST_N: U3.4(A3)
RX: U3.13(B1) U4.11(IO18) U14.3
SCL: DP1.2(SCL) U4.25(IO48) U7.2(SCL) U13.8(SMCLK) U14.6
SDA: DP1.3(SDA) U4.24(IO47) U7.1(SDA) U13.7(SMDATA) U14.5
TEMP_N: R2.1 U10.21(TEMP_N)
TEMP_P: R1.1 U10.22(TEMP_P)
TX: U3.12(B2) U4.10(IO17) U14.4
VOUT: C23.1 C24.1 L1.2 R10.1 R12.2
XIN32: C7.2 U4.8(IO15) X1.1
XOUT32: C6.2 U4.9(IO16) X1.2
Net-(C1-1): C1.1 U3.1(VCCA) U3.7(GND) U3.8(OE)
Net-(C1-2): C1.2 U3.14(VCCB)
Net-(C3-1): C3.1 R18.2 U4.3(EN)
Net-(C10-1): C10.1 C11.2 U10.30(VDD1_1)
Net-(C11-1): C11.1 C12.2 U10.31(VDD2_1)
Net-(C12-1): C12.1 C27.2 U10.32(VDD3_1)
Net-(C13-1): C13.1 U6.6(BOOT)
Net-(C13-2): C13.2 L1.1 Q1.3(S) Q2.5(D) U6.8(SW)
Net-(C14-2): C14.2 R8.2 U6.10(BP)
Net-(C15-2): C15.2 C16.2 C18.1 C19.1 C20.1 C21.2 C22.2 R11.2 U6.4(COMP)
Net-(C16-1): C16.1 R9.1
Net-(C17-2): C17.2 R10.2
Net-(C18-2): C18.2 C19.2 C20.2 C21.1 C22.1 Q1.5(D) U6.1(VDD)
Net-(C25-2): C25.2 R13.2 U7.4(GND)
Net-(C28-1): C28.1 C29.2 U10.1(VDD3_0)
Net-(C29-1): C29.1 C30.2 U10.2(VDD2_0)
Net-(C30-1): C30.1 C31.2 U10.3(VDD1_0)
Net-(C36-1): C36.1 R1.2 U13.2(DP)
Net-(C36-2): C36.2 R2.2 U13.3(DN)
Net-(C37-1): C37.1 C38.2 U1.30(VDD1_1)
Net-(C38-1): C38.1 C39.2 U1.31(VDD2_1)
Net-(C39-1): C39.1 C40.2 U1.32(VDD3_1)
Net-(C41-1): C41.1 C42.2 U1.1(VDD3_0)
Net-(C42-1): C42.1 C43.2 U1.2(VDD2_0)
Net-(C43-1): C43.1 C44.2 U1.3(VDD1_0)
Net-(C89-1): C89.1 R27.1 U9.4(BP/FB)
Net-(C140-1): C140.1 R25.1 R26.2 U9.1(IN)
Net-(C141-1): C141.1 R35.1 R36.2 U11.1(IN)
Net-(C142-1): C142.1 R34.1 U11.4(BP/FB)
Net-(C145-1): C145.1 U12.1(GND)
Net-(Q1-4): Q1.4(G) U6.7(HDRV)
Net-(Q2-4): Q2.4(G) R7.1 U6.9(LDRVOC)
Net-(R6-2): R6.2 U1.4(ADDR0)
Net-(R8-1): R8.1 U6.3(PGOOD)
Net-(R11-1): R11.1 R12.1
Net-(R13-1): R13.1 U7.5(FS0)
Net-(R15-2): R15.2 U10.6(ADDR2)
Net-(R16-2): R16.2 U10.5(ADDR1)
Net-(R17-2): R17.2 U10.4(ADDR0)
Net-(R21-2): R21.2 U1.5(ADDR1)
Net-(R22-2): R22.2 U1.6(ADDR2)
Net-(R25-2): R25.2 U9.3(EN)
Net-(R35-2): R35.2 U11.3(EN)

Not connected (* = marked no-connect by the designer): Q1 1(S) 2(S) 6(D) 7(D) 8(D) 9(D); Q2 1(S) 2(S) 6(D) 7(D) 8(D) 9(D); U1 7(TEST) 21(TEMP_N) 22(TEMP_P) 23(RF) 24(TF); U3 6(NC) 9(NC) 15(EP); U4 4(IO4) 12(IO8) 14(IO20) 15(IO3) 16(IO46) 17(IO9) 19(IO11) 21(IO13) 22(IO14) 23(IO21) 26(IO45) 27(IO0) 31(IO38) 40(GND) 41(GND); U5 4(NC); U6 2(ENSS); U7 3(FS1); U8 2(IN+) 3(IN+) 7(ALERT) 8(SDA) 9(SCL) 10(VS) 13(NC) 14(IN-) 15(IN-) 16(IN-); U10 7(TEST) 23(RF) 24(TF); X2 5

## Notes on the sheets
sheet 1
- EMC2101-R-ACZL-TR COPY
sheet 3
- GND
sheet 5
- GND
sheet 7
- 330uF
- 330uF
- 330uF
